# EAGLE design teensyMotors02_upSwitch_LED (EAGLE 9.1.3)
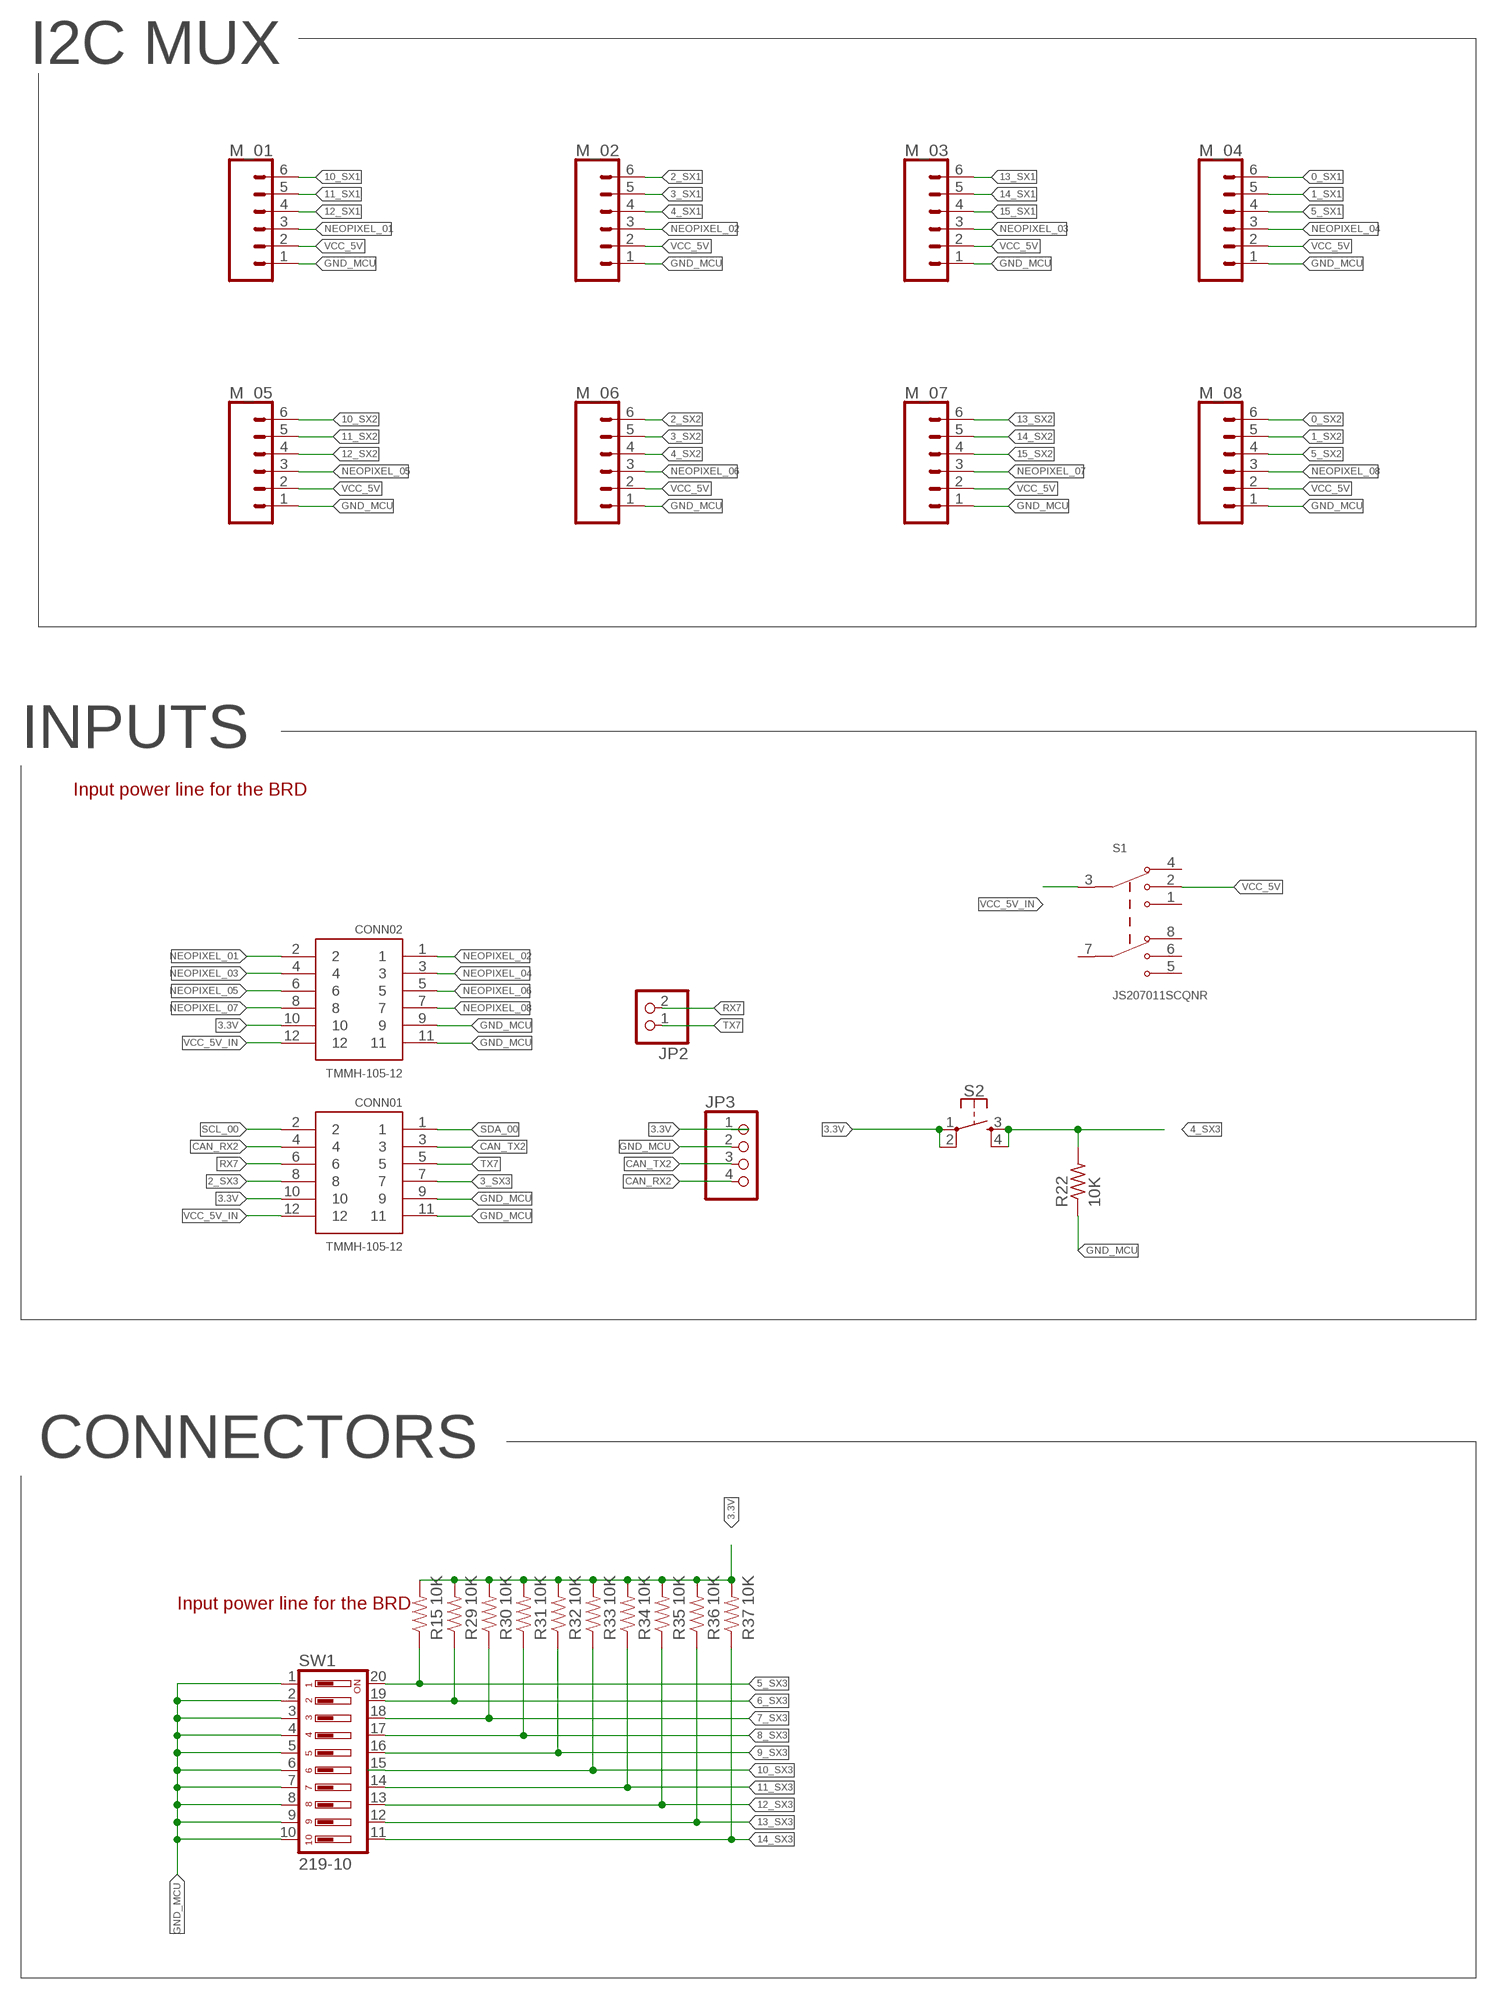
[diagram p0: schematic, sheet 1, part 1 of 3]
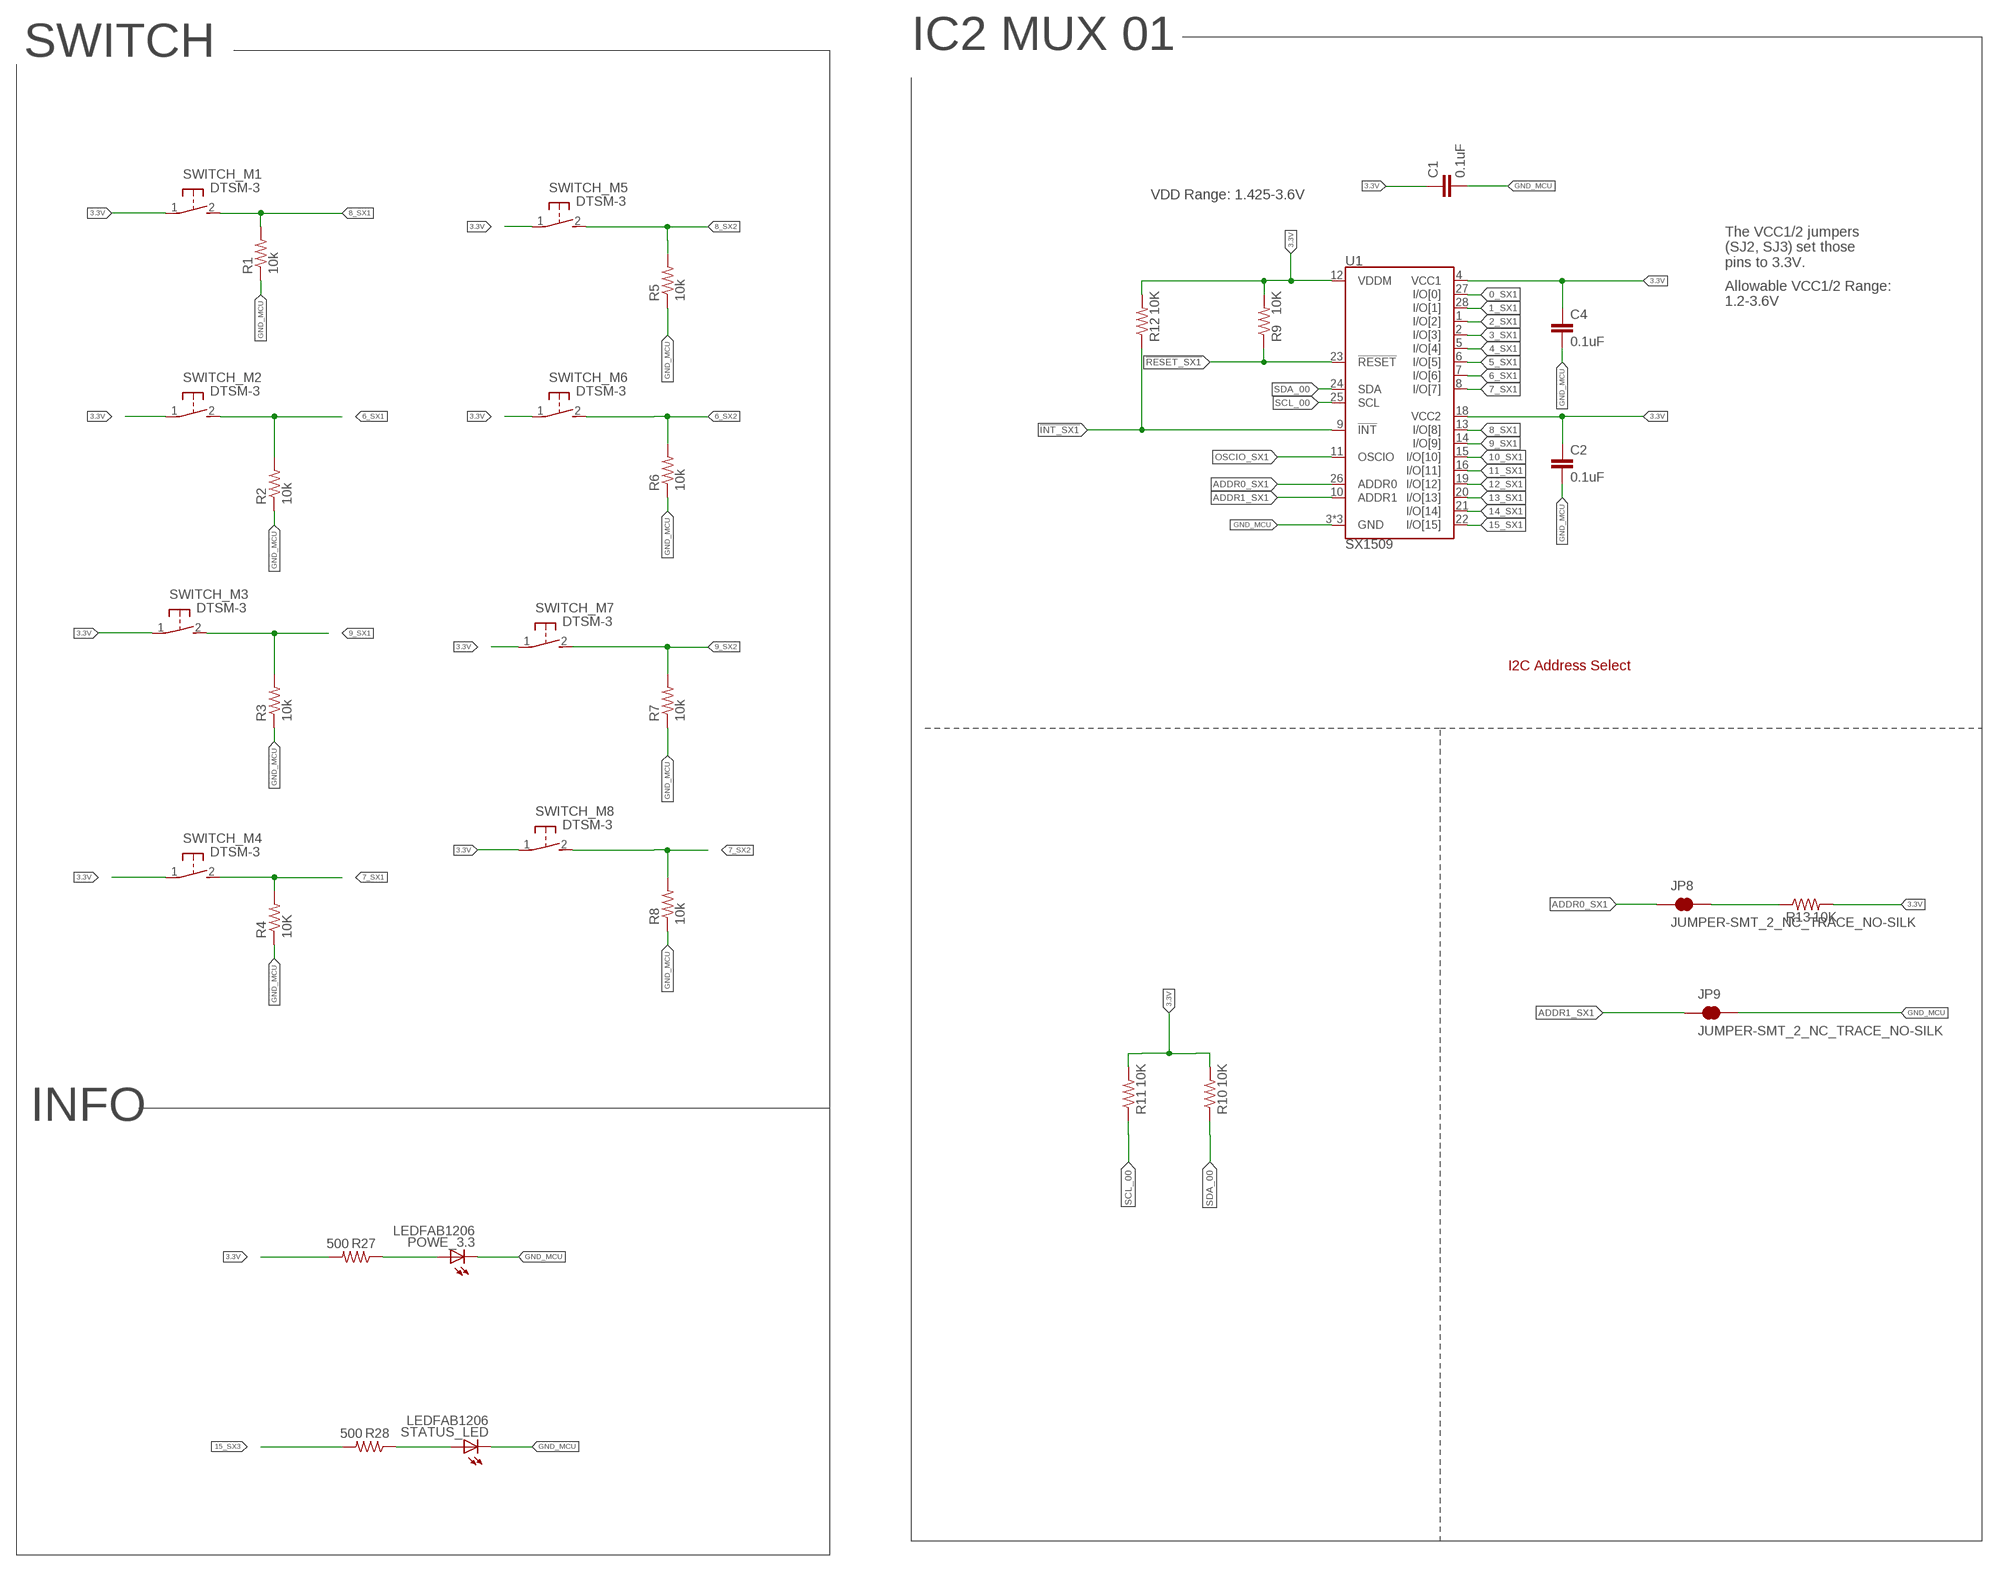
[diagram p1: schematic, sheet 1, part 2 of 3]
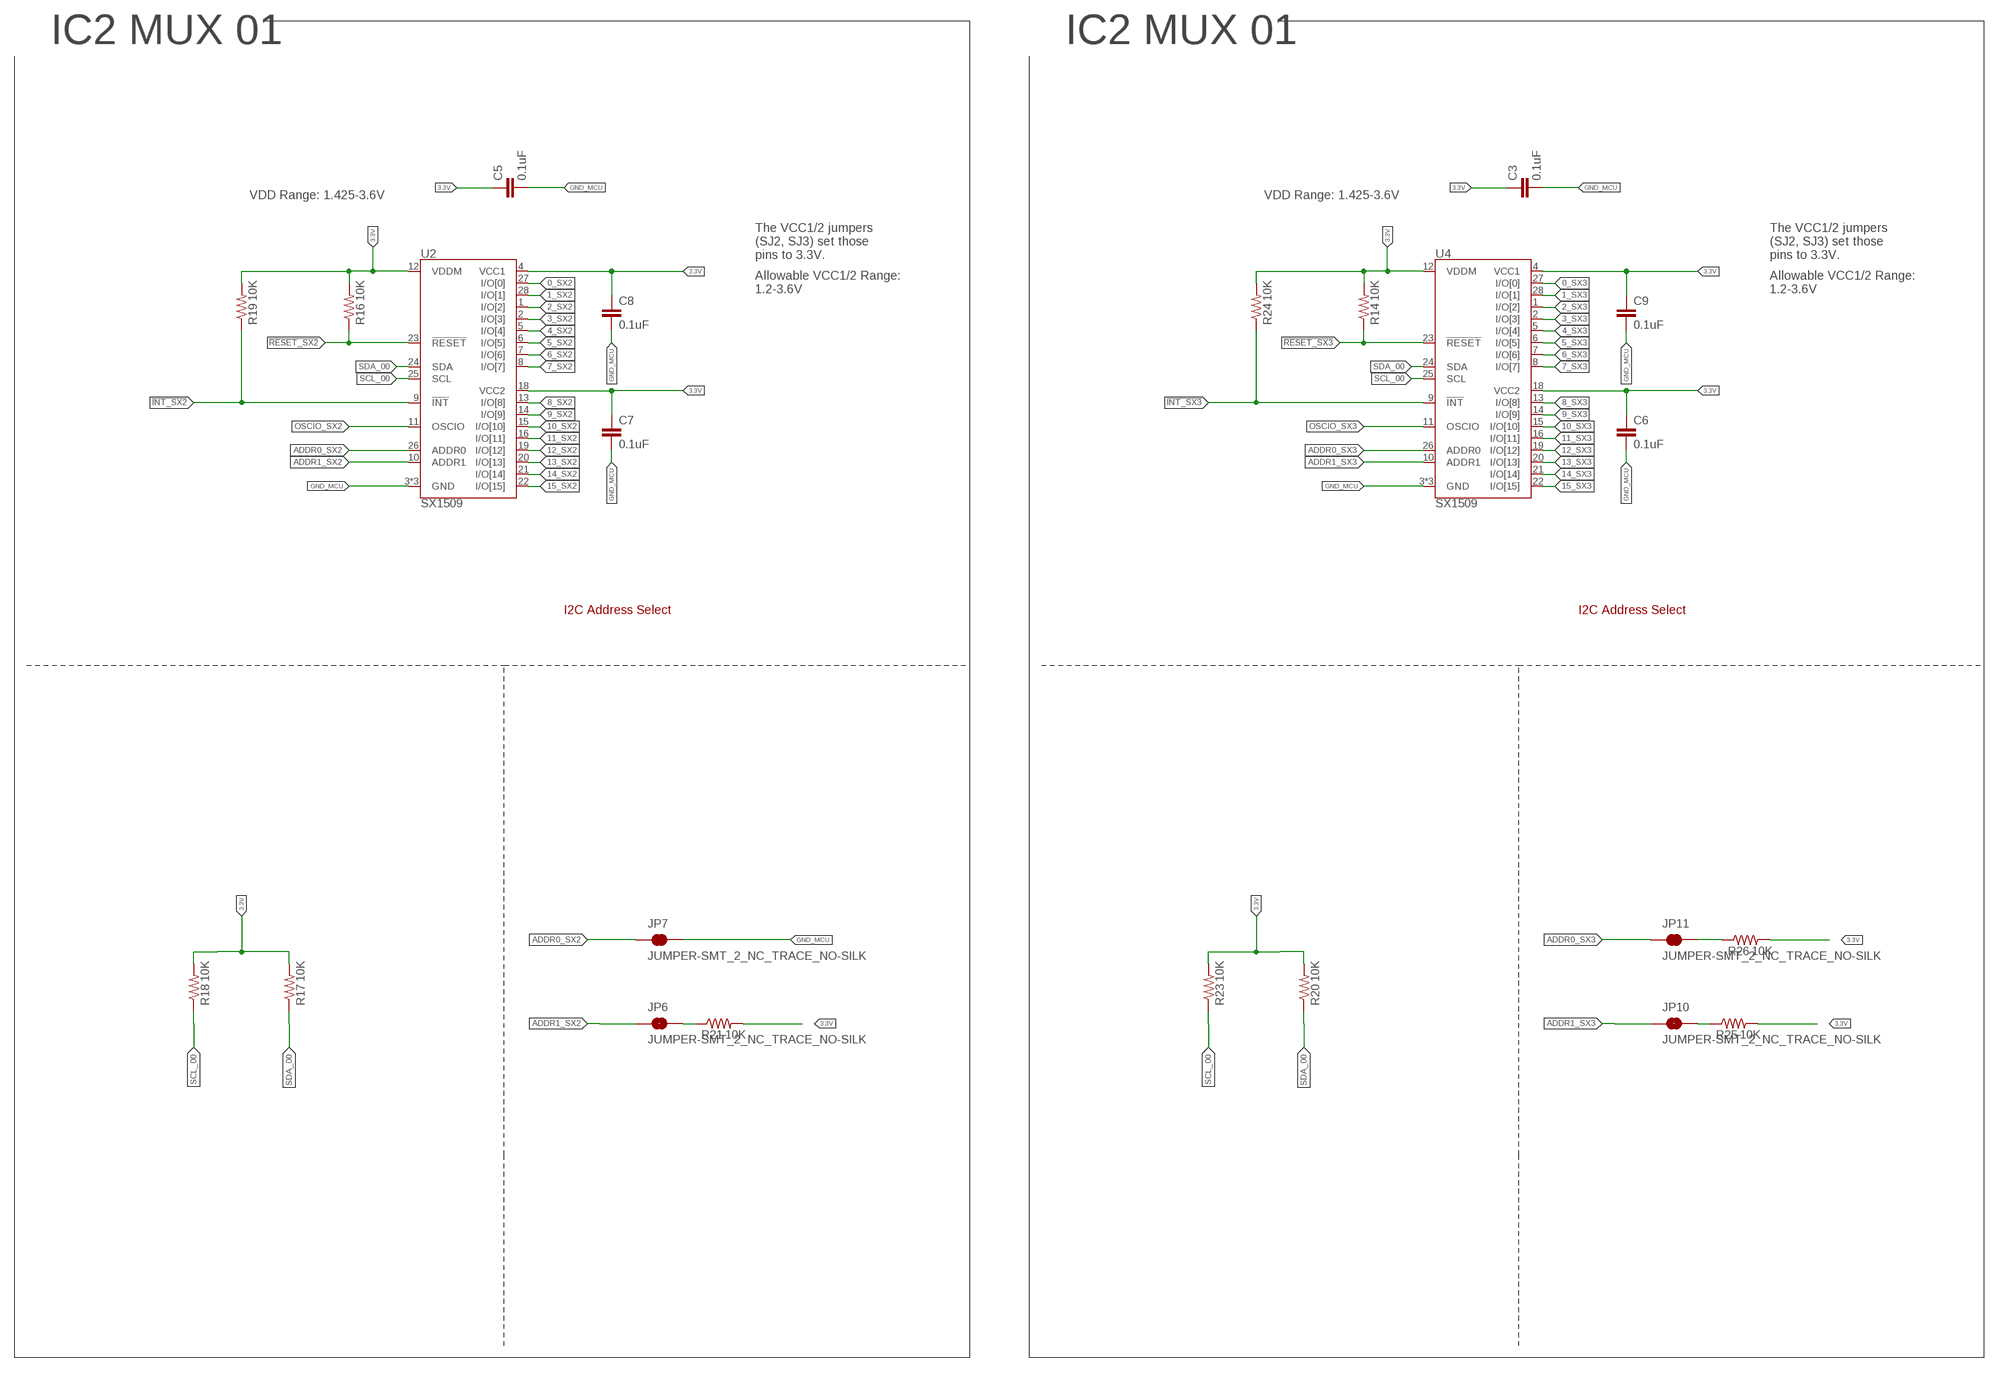
[diagram p2: schematic, sheet 1, part 3 of 3]

## Parts
C1  0.1uF  0.1UF-25V(+80/-20%)(0603)  [0603-CAP]
C2  0.1uF  0.1UF-25V(+80/-20%)(0603)  [0603-CAP]
C3  0.1uF  0.1UF-25V(+80/-20%)(0603)  [0603-CAP]
C4  0.1uF  0.1UF-25V(+80/-20%)(0603)  [0603-CAP]
C5  0.1uF  0.1UF-25V(+80/-20%)(0603)  [0603-CAP]
C6  0.1uF  0.1UF-25V(+80/-20%)(0603)  [0603-CAP]
C7  0.1uF  0.1UF-25V(+80/-20%)(0603)  [0603-CAP]
C8  0.1uF  0.1UF-25V(+80/-20%)(0603)  [0603-CAP]
C9  0.1uF  0.1UF-25V(+80/-20%)(0603)  [0603-CAP]
CONN01  TMMH-105-12  [TMMH-105-12]
CONN02  TMMH-105-12  [TMMH-105-12]
JP2  HEADER-1X2ROUND  [1X02_ROUND]
JP3  HEADER-1X4ROUND  [1X04_ROUND]
JP6  JUMPER-SMT_2_NC_TRACE_NO-SILK  [SMT-JUMPER_2_NC_TRACE_NO-SILK]
JP7  JUMPER-SMT_2_NC_TRACE_NO-SILK  [SMT-JUMPER_2_NC_TRACE_NO-SILK]
JP8  JUMPER-SMT_2_NC_TRACE_NO-SILK  [SMT-JUMPER_2_NC_TRACE_NO-SILK]
JP9  JUMPER-SMT_2_NC_TRACE_NO-SILK  [SMT-JUMPER_2_NC_TRACE_NO-SILK]
JP10  JUMPER-SMT_2_NC_TRACE_NO-SILK  [SMT-JUMPER_2_NC_TRACE_NO-SILK]
JP11  JUMPER-SMT_2_NC_TRACE_NO-SILK  [SMT-JUMPER_2_NC_TRACE_NO-SILK]
M_01  CONN_06SMD-1MM  [1X06-1MM]
M_02  CONN_06SMD-1MM  [1X06-1MM]
M_03  CONN_06SMD-1MM  [1X06-1MM]
M_04  CONN_06SMD-1MM  [1X06-1MM]
M_05  CONN_06SMD-1MM  [1X06-1MM]
M_06  CONN_06SMD-1MM  [1X06-1MM]
M_07  CONN_06SMD-1MM  [1X06-1MM]
M_08  CONN_06SMD-1MM  [1X06-1MM]
POWE_3.3  LEDFAB1206  [LED1206FAB]
R1  10k  R-US_M0805  [M0805]
R2  10k  R-US_M0805  [M0805]
R3  10k  R-US_M0805  [M0805]
R4  10K  R-US_M0805  [M0805]
R5  10k  R-US_M0805  [M0805]
R6  10k  R-US_M0805  [M0805]
R7  10k  R-US_M0805  [M0805]
R8  10k  R-US_M0805  [M0805]
R9  10K  10KOHM-1/10W-1%(0603)0603  [0603-RES]
R10  10K  10KOHM-1/10W-1%(0603)0603  [0603-RES]
R11  10K  10KOHM-1/10W-1%(0603)0603  [0603-RES]
R12  10K  10KOHM-1/10W-1%(0603)0603  [0603-RES]
R13  10K  10KOHM-1/10W-1%(0603)0603  [0603-RES]
R14  10K  10KOHM-1/10W-1%(0603)0603  [0603-RES]
R15  10K  10KOHM-1/10W-1%(0603)0603  [0603-RES]
R16  10K  10KOHM-1/10W-1%(0603)0603  [0603-RES]
R17  10K  10KOHM-1/10W-1%(0603)0603  [0603-RES]
R18  10K  10KOHM-1/10W-1%(0603)0603  [0603-RES]
R19  10K  10KOHM-1/10W-1%(0603)0603  [0603-RES]
R20  10K  10KOHM-1/10W-1%(0603)0603  [0603-RES]
R21  10K  10KOHM-1/10W-1%(0603)0603  [0603-RES]
R22  10K  R-US_M0805  [M0805]
R23  10K  10KOHM-1/10W-1%(0603)0603  [0603-RES]
R24  10K  10KOHM-1/10W-1%(0603)0603  [0603-RES]
R25  10K  10KOHM-1/10W-1%(0603)0603  [0603-RES]
R26  10K  10KOHM-1/10W-1%(0603)0603  [0603-RES]
R27  500  10KOHM-1/10W-1%(0603)0603  [0603-RES]
R28  500  10KOHM-1/10W-1%(0603)0603  [0603-RES]
R29  10K  10KOHM-1/10W-1%(0603)0603  [0603-RES]
R30  10K  10KOHM-1/10W-1%(0603)0603  [0603-RES]
R31  10K  10KOHM-1/10W-1%(0603)0603  [0603-RES]
R32  10K  10KOHM-1/10W-1%(0603)0603  [0603-RES]
R33  10K  10KOHM-1/10W-1%(0603)0603  [0603-RES]
R34  10K  10KOHM-1/10W-1%(0603)0603  [0603-RES]
R35  10K  10KOHM-1/10W-1%(0603)0603  [0603-RES]
R36  10K  10KOHM-1/10W-1%(0603)0603  [0603-RES]
R37  10K  10KOHM-1/10W-1%(0603)0603  [0603-RES]
S1  JS207011SCQNR  [SW_JS207011SCQNR]
S2  MOMENTARY-SWITCH-SPST-2-SMD-5.2MM  [TACTILE_SWITCH_SMD_5.2MM]
STATUS_LED  LEDFAB1206  [LED1206FAB]
SW1  219-10  [CTS-219-10]
SWITCH_M1  DTSM-3  [DTSM-3]
SWITCH_M2  DTSM-3  [DTSM-3]
SWITCH_M3  DTSM-3  [DTSM-3]
SWITCH_M4  DTSM-3  [DTSM-3]
SWITCH_M5  DTSM-3  [DTSM-3]
SWITCH_M6  DTSM-3  [DTSM-3]
SWITCH_M7  DTSM-3  [DTSM-3]
SWITCH_M8  DTSM-3  [DTSM-3]
U1  SX1509  [QFN-28]
U2  SX1509  [QFN-28]
U4  SX1509  [QFN-28]

## Nets
0_SX1: M_04.6 U1.27(I/O[0])
0_SX2: M_08.6 U2.27(I/O[0])
0_SX3: U4.27(I/O[0])
1_SX1: M_04.5 U1.28(I/O[1])
1_SX2: M_08.5 U2.28(I/O[1])
1_SX3: U4.28(I/O[1])
2_SX1: M_02.6 U1.1(I/O[2])
2_SX2: M_06.6 U2.1(I/O[2])
2_SX3: CONN01.8 U4.1(I/O[2])
3.3V: C1.1 C2.1 C3.1 C4.1 C5.1 C6.1 C7.1 C8.1 C9.1 CONN01.10 CONN02.10 JP3.1 R9.2 R10.2 R11.2 R12.2 R13.2 R14.2 R15.2 R16.2 R17.2 R18.2 R19.2 R20.2 R21.2 R23.2 R24.2 R25.2 R26.2 R27.2 R29.2 R30.2 R31.2 R32.2 R33.2 R34.2 R35.2 R36.2 R37.2 S2.1 S2.2 SWITCH_M1.1 SWITCH_M2.1 SWITCH_M3.1 SWITCH_M4.1 SWITCH_M5.1 SWITCH_M6.1 SWITCH_M7.1 SWITCH_M8.1 U1.4(VCC1) U1.12(VDDM) U1.18(VCC2) U2.4(VCC1) U2.12(VDDM) U2.18(VCC2) U4.4(VCC1) U4.12(VDDM) U4.18(VCC2)
3_SX1: M_02.5 U1.2(I/O[3])
3_SX2: M_06.5 U2.2(I/O[3])
3_SX3: CONN01.7 U4.2(I/O[3])
4_SX1: M_02.4 U1.5(I/O[4])
4_SX2: M_06.4 U2.5(I/O[4])
4_SX3: R22.2 S2.3 S2.4 U4.5(I/O[4])
5_SX1: M_04.4 U1.6(I/O[5])
5_SX2: M_08.4 U2.6(I/O[5])
5_SX3: R15.1 SW1.20 U4.6(I/O[5])
6_SX1: R2.2 SWITCH_M2.2 U1.7(I/O[6])
6_SX2: R6.2 SWITCH_M6.2 U2.7(I/O[6])
6_SX3: R29.1 SW1.19 U4.7(I/O[6])
7_SX1: R4.2 SWITCH_M4.2 U1.8(I/O[7])
7_SX2: R8.2 SWITCH_M8.2 U2.8(I/O[7])
7_SX3: R30.1 SW1.18 U4.8(I/O[7])
8_SX1: R1.2 SWITCH_M1.2 U1.13(I/O[8])
8_SX2: R5.2 SWITCH_M5.2 U2.13(I/O[8])
8_SX3: R31.1 SW1.17 U4.13(I/O[8])
9_SX1: R3.2 SWITCH_M3.2 U1.14(I/O[9])
9_SX2: R7.2 SWITCH_M7.2 U2.14(I/O[9])
9_SX3: R32.1 SW1.16 U4.14(I/O[9])
10_SX1: M_01.6 U1.15(I/O[10])
10_SX2: M_05.6 U2.15(I/O[10])
10_SX3: R33.1 SW1.15 U4.15(I/O[10])
11_SX1: M_01.5 U1.16(I/O[11])
11_SX2: M_05.5 U2.16(I/O[11])
11_SX3: R34.1 SW1.14 U4.16(I/O[11])
12_SX1: M_01.4 U1.19(I/O[12])
12_SX2: M_05.4 U2.19(I/O[12])
12_SX3: R35.1 SW1.13 U4.19(I/O[12])
13_SX1: M_03.6 U1.20(I/O[13])
13_SX2: M_07.6 U2.20(I/O[13])
13_SX3: R36.1 SW1.12 U4.20(I/O[13])
14_SX1: M_03.5 U1.21(I/O[14])
14_SX2: M_07.5 U2.21(I/O[14])
14_SX3: R37.1 SW1.11 U4.21(I/O[14])
15_SX1: M_03.4 U1.22(I/O[15])
15_SX2: M_07.4 U2.22(I/O[15])
15_SX3: R28.2 U4.22(I/O[15])
!INT_SX1: R12.1 U1.9(!INT)
!INT_SX2: R19.1 U2.9(!INT)
!INT_SX3: R24.1 U4.9(!INT)
!RESET_SX1: R9.1 U1.23(!RESET)
!RESET_SX2: R16.1 U2.23(!RESET)
!RESET_SX3: R14.1 U4.23(!RESET)
ADDR0_SX1: JP8.1 U1.26(ADDR0)
ADDR0_SX2: JP7.1 U2.26(ADDR0)
ADDR0_SX3: JP11.1 U4.26(ADDR0)
ADDR1_SX1: JP9.1 U1.10(ADDR1)
ADDR1_SX2: JP6.1 U2.10(ADDR1)
ADDR1_SX3: JP10.1 U4.10(ADDR1)
CAN_RX2: CONN01.4 JP3.4
CAN_TX2: CONN01.3 JP3.3
GND_MCU: C1.2 C2.2 C3.2 C4.2 C5.2 C6.2 C7.2 C8.2 C9.2 CONN01.9 CONN01.11 CONN02.9 CONN02.11 JP3.2 JP7.2 JP9.2 M_01.1 M_02.1 M_03.1 M_04.1 M_05.1 M_06.1 M_07.1 M_08.1 POWE_3.3.2(C) R1.1 R2.1 R3.1 R4.1 R5.1 R6.1 R7.1 R8.1 R22.1 STATUS_LED.2(C) SW1.1 SW1.2 SW1.3 SW1.4 SW1.5 SW1.6 SW1.7 SW1.8 SW1.9 SW1.10 U1.3(GND) U1.17(GND) U1.29(GND) U2.3(GND) U2.17(GND) U2.29(GND) U4.3(GND) U4.17(GND) U4.29(GND)
N$5: JP6.2 R21.1
N$8: JP8.2 R13.1
N$13: R28.1 STATUS_LED.1(A)
N$14: JP10.2 R25.1
N$15: JP11.2 R26.1
N$193: POWE_3.3.1(A) R27.1
NEOPIXEL_01: CONN02.2 M_01.3
NEOPIXEL_02: CONN02.1 M_02.3
NEOPIXEL_03: CONN02.4 M_03.3
NEOPIXEL_04: CONN02.3 M_04.3
NEOPIXEL_05: CONN02.6 M_05.3
NEOPIXEL_06: CONN02.5 M_06.3
NEOPIXEL_07: CONN02.8 M_07.3
NEOPIXEL_08: CONN02.7 M_08.3
OSCIO_SX1: U1.11(OSCIO)
OSCIO_SX2: U2.11(OSCIO)
OSCIO_SX3: U4.11(OSCIO)
RX7: CONN01.6 JP2.2
SCL_00: CONN01.2 R11.1 R18.1 R23.1 U1.25(SCL) U2.25(SCL) U4.25(SCL)
SDA_00: CONN01.1 R10.1 R17.1 R20.1 U1.24(SDA) U2.24(SDA) U4.24(SDA)
TX7: CONN01.5 JP2.1
VCC_5V [5v]: M_01.2 M_02.2 M_03.2 M_04.2 M_05.2 M_06.2 M_07.2 M_08.2 S1.2
VCC_5V_IN [5v]: CONN01.12 CONN02.12 S1.3
Unconnected: S1.1 S1.4 S1.5 S1.6 S1.7 S1.8

## Notes on the sheet
- I2C MUX | SWITCH | IC2 MUX 01 | IC2 MUX 01 | IC2 MUX 01
- VDD Range: 1.425-3.6V
- VDD Range: 1.425-3.6V | VDD Range: 1.425-3.6V
- The VCC1/2 jumpers 
  (SJ2, SJ3) set those 
  pins to 3.3V.
- Allowable VCC1/2 Range: 
  1.2-3.6V
- The VCC1/2 jumpers 
  (SJ2, SJ3) set those 
  pins to 3.3V.
- The VCC1/2 jumpers 
  (SJ2, SJ3) set those 
  pins to 3.3V.
- Allowable VCC1/2 Range: 
  1.2-3.6V
- Allowable VCC1/2 Range: 
  1.2-3.6V
- INPUTS
- Input power line for the BRD
- I2C Address Select
- I2C Address Select | I2C Address Select
- INFO
- CONNECTORS
- Input power line for the BRD

## Library data of the parts
C1-C9 = SparkFun-Capacitors:0.1UF-25V(+80/-20%)(0603): CAP-00810 Ceramic Standard decoupling cap; PROD_ID: CAP-00810
CONN01 CONN02 = TMMH-105-XX-XX-DV:TMMH-105-12: 2mm (.0787") Flex Shroud, .020" (.51mm) Square Post Terminal Strip, Surface Mount,10 Pins.
JP2 = microbuilder:HEADER-1X2: PIN HEADER
JP3 = microbuilder:HEADER-1X4: PIN HEADER
JP6-JP11 = SparkFun-Jumpers:JUMPER-SMT_2_NC_TRACE: Normally closed trace jumper This jumper has a trace between two pads so it's normally closed (NC). Use a razor knife to open the connection. For best results follow the IPC guidelines for cutting traces: Cutout at least 0.063 mm (0.005 in). Remove all loose material to clean up the cut area. Seal the cut with an approved epoxy. Reapply solder to reclose the connection.
M_01-M_08 = SparkFun-Connectors:CONN_06: Multi connection point. Often used as Generic Header-pin footprint for 0.1 inch spaced/style header connections On any of the 0.1 inch spaced packages, you can populate with these: Break Away Headers - Straight <https://www.sparkfun.com/products/116> (PRT-00116) Break Away Male Headers - Right Angle <https://www.sparkfun.com/products/553> (PRT-00553) Female Headers <https://www.sparkfun.com/products/115> (PRT-00115) Break Away Headers - Machine Pin <https://www.sparkfun.com/products/117> (PRT-00117) Break Away Female Headers - Swiss Machine Pin <https://www.sparkfun.com/products/743> (PRT-00743) Arduino Stackable Header - 6 Pin <https://www.sparkfun.com/products/9280> (PRT-09280) For SCREWTERMINALS and SPRING TERMINALS visit here: Screw Terimnals on SparkFun.com <https://www.sparkfun.com/search/results?term=Screw+Terminals> (5mm/3.5mm/2.54mm spacing) This device is also useful as a general connection point to wire up your design to another part of your project. Our various solder wires solder well into these plated through hole pads. Hook-Up Wire - Assortment (Stranded, 22 AWG) <https://www.sparkfun.com/products/11375> (PRT-11375) Hook-Up Wire - Assortment (Solid Core, 22 AWG) <https://www.sparkfun.com/products/11367> (PRT-11367) View the entire wire category on our website here <https://www.sparkfun.com/categories/141>; PROD_ID: CONN-08249; SF_ID: GPS-00579
POWE_3.3 STATUS_LED = fab:LED: LED
R1-R8 R22 = resistor:R-US_: RESISTOR, American symbol
R9-R21 R23-R26 R29-R37 = SparkFun-Resistors:10KOHM-1/10W-1%(0603): RES-00824; PROD_ID: RES-00824
R27 R28 = SparkFun-Resistors:10KOHM-1/10W-1%(0603): RES-00824; PROD_ID: RES-00824; VALUE: 10K
S1 = JS207011SCQNR:JS207011SCQNR: Js Series Sub-Miniature Slide Switches; AVAILABILITY: Unavailable; DESCRIPTION: Slide Switch DP3T Surface Mount; MF: C&K; MP: JS207011SCQNR; PACKAGE: None; PRICE: None
S2 = SparkFun-Switches:MOMENTARY-SWITCH-SPST-2: Momentary Switch (Pushbutton) - SPST - Two Circuits Normally-open (NO) SPST momentary switches (buttons, pushbuttons). Schematic symbol includes two switch circuits. Variants SMD-4.6MMX2.8MM - 4.60mm x 2.80mm Tactile Momentary Button Switch - Used on SparkFun SAMD21 Mini Breakout <https://www.sparkfun.com/products/13664> SMD-5.2MM - Mini Pushbutton Switch - SMD <https://www.sparkfun.com/products/8720> - Used on Arduino Pro Mini <https://www.sparkfun.com/products/11114>; PROD_ID: SWCH-08247; SF_SKU: COM-08720
SW1 = switch-dil:219-10*: Surface Mount DIP Switch Series 219 SMT CTS Electronic Components Sourc: www.ctscorp.com; MF: SLI (CML/IDI); MPN: 219-10PK; OC_FARNELL: unknown; OC_NEWARK: 19M0224
SWITCH_M1-SWITCH_M8 = switch-tact:DTSM-3
U1 U2 U4 = SparkFun-DigitalIC:SX1509: Semtech SX1509 The SX1509 is a complete ultra low voltage 1.2V to 3.6V General Purpose parallel Input/Output (GPIO) expanders ideal for low power handheld battery powered equipment. This version comes in a 16-channel configuration and allows easy serial expansion of I/O through a standard 400kHz I2C interface. GPIO devices can provide additional control and monitoring when the microcontroller or chipset has insufficient I/O ports, or in systems where serial communication and control from a remote location is advantageous.; PROD_ID: IC-11311

## Net classes
0 default: width 0.2 mm, clearance 0.2 mm
1 gnd: width 0.2 mm, clearance 0.2 mm
4 5v: width 0.35 mm, clearance 0.2 mm

## Board
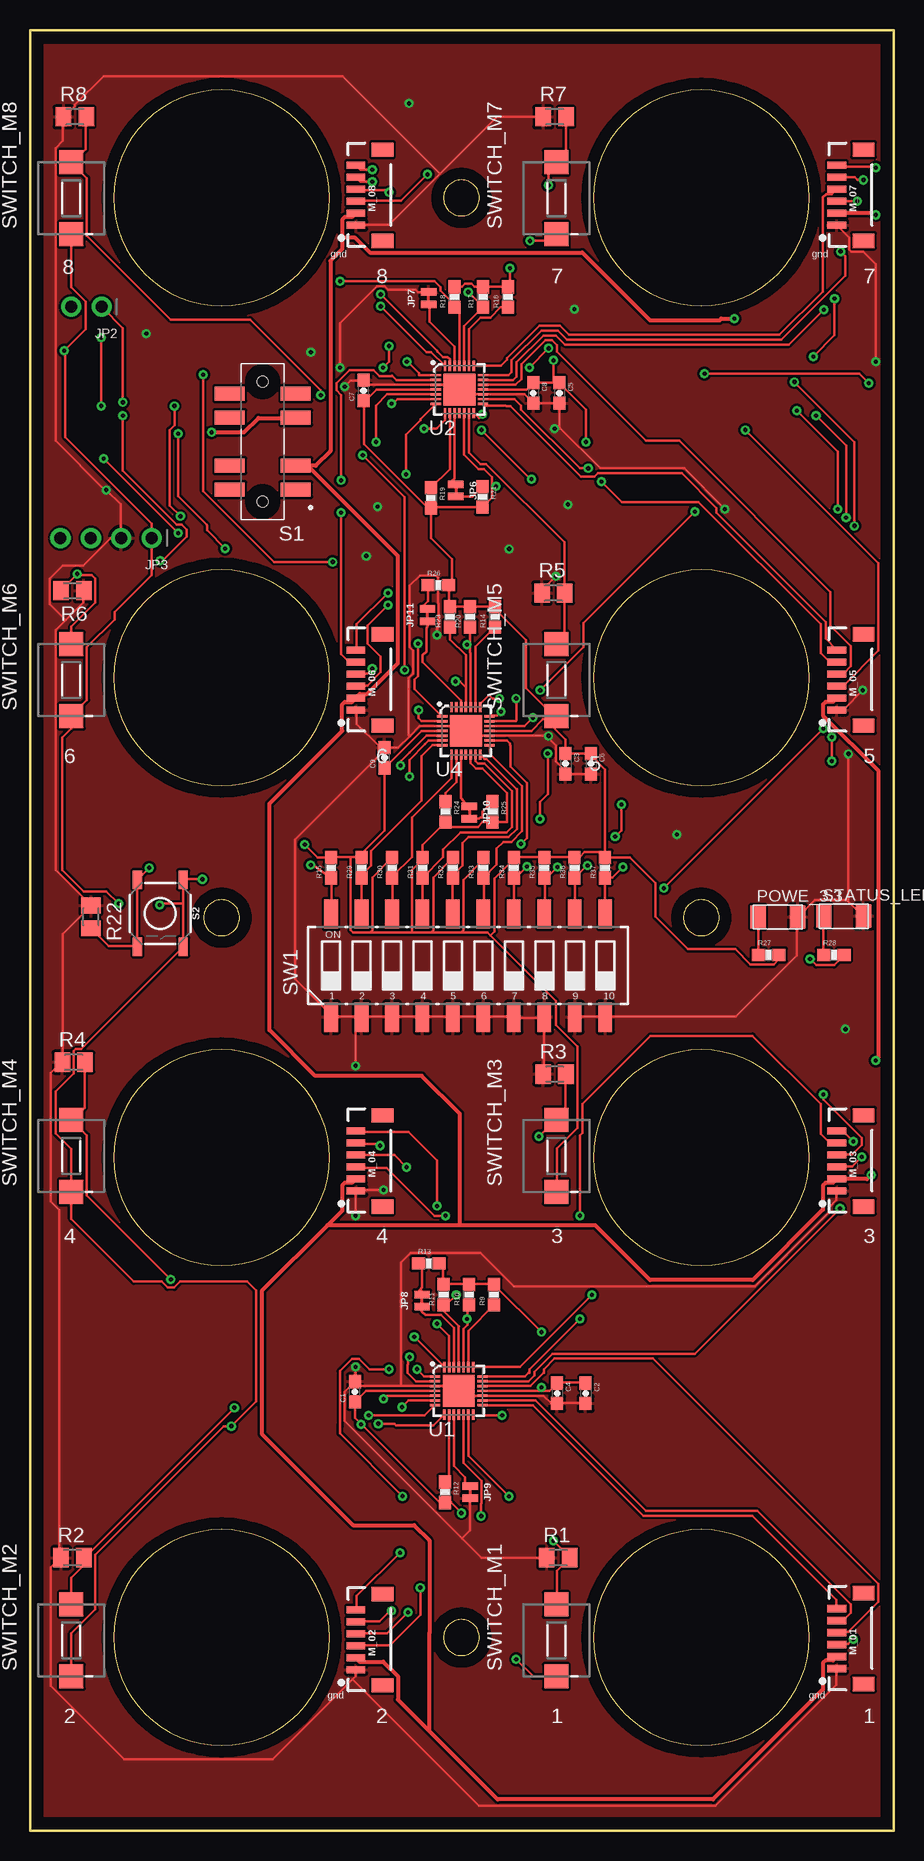
[diagram p3: board, top side]
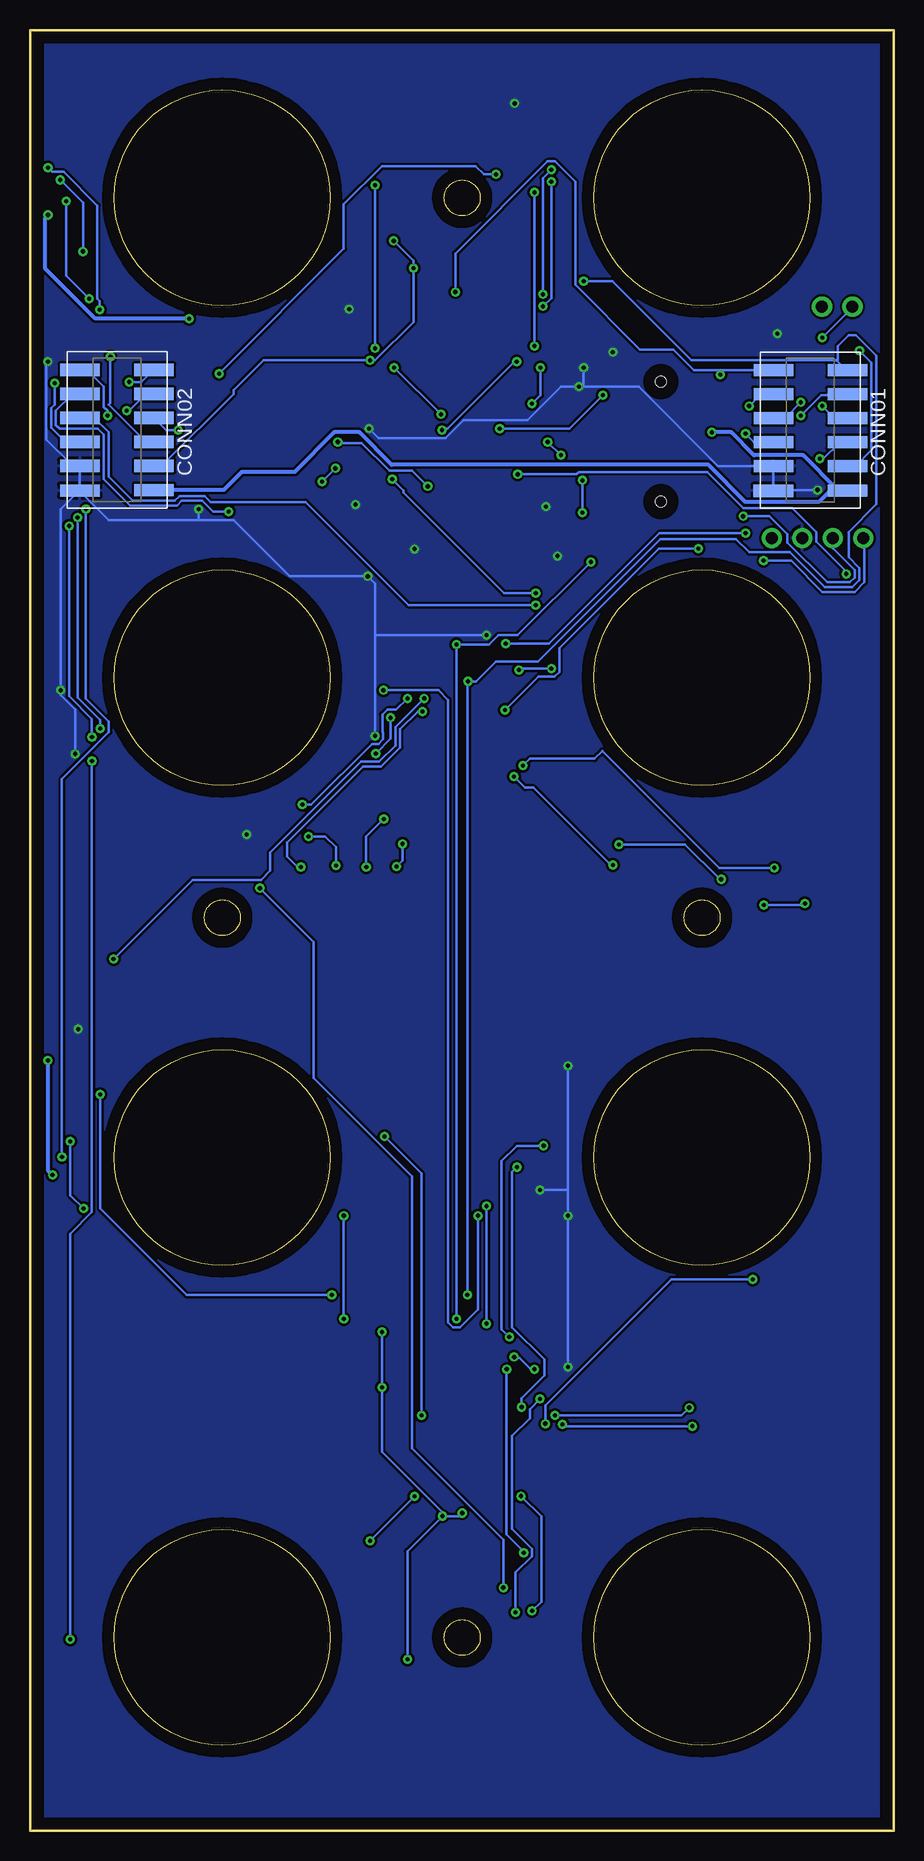
[diagram p4: board, bottom side, seen from below]

Size 72.01 x 150.09 mm. Coordinates in mm from the lower left corner, seen from the top.
Outline: 35.97,14.59 arc180 35.97,17.59 arc180 35.97,14.59
Outline: 15.97,74.59 arc180 15.97,77.59 arc180 15.97,74.59
Outline: 35.97,134.59 arc180 35.97,137.59 arc180 35.97,134.59
Outline: 55.97,74.59 arc180 55.97,77.59 arc180 55.97,74.59
Outline: 15.97,127.09 arc180 15.97,145.09 arc180 15.97,127.09
Outline: 55.97,127.09 arc180 55.97,145.09 arc180 55.97,127.09
Outline: 55.97,87.09 arc180 55.97,105.09 arc180 55.97,87.09
Outline: 55.97,47.09 arc180 55.97,65.09 arc180 55.97,47.09
Outline: 55.97,7.09 arc180 55.97,25.09 arc180 55.97,7.09
Outline: 15.97,7.09 arc180 15.97,25.09 arc180 15.97,7.09
Outline: 15.97,47.09 arc180 15.97,65.09 arc180 15.97,47.09
Outline: 15.97,87.09 arc180 15.97,105.09 arc180 15.97,87.09
Outline: 72.01,150.09 72.01,0 0,0 0,150.09 72.01,150.09
Copper layers (1*16): Top 0.035mm / dielectric 1.5mm / Bottom 0.035mm
Design rules "default": minimum track width 6mil, minimum drill 0.35mm, track to track 6mil, track to pad 6mil, pad to pad 6mil, via to via 6mil, smd to smd 6mil, copper to edge 40mil, drill to drill 6mil, minimum pad ring 10mil, minimum via ring 8mil, stop-mask expansion 4mil, vias tented up to drill 0mil, thermal gap 10mil

### Footprints (pad centres in the part's own frame; a part is rotated, then mirrored left to right if it is on the bottom)
0603-CAP = smd 1.1 x 1: 1 -0.85,0; 2 0.85,0
TMMH-105-12 = smd 1.016 x 3.302: 1 -5.27,-3.086; 2 -5.27,3.086; 3 -3.27,-3.086; 4 -3.27,3.086; 5 -1.27,-3.086; 6 -1.27,3.086; 7 0.73,-3.086; 8 0.73,3.086; 9 2.73,-3.086; 10 2.73,3.086; 11 4.781,-3.099; 12 4.755,3.086
1X02_ROUND = drill 1 pad 1.676: 1 -1.27,0; 2 1.27,0
1X04_ROUND = drill 1 pad 1.676: 1 -3.81,0; 2 -1.27,0; 3 1.27,0; 4 3.81,0
SMT-JUMPER_2_NC_TRACE_NO-SILK = smd 0.635 x 1.27: 1 -0.508,0; 2 0.508,0
1X06-1MM = smd 0.6 x 1.55: 1 -2.54,1.27; 2 -1.54,1.27; 3 -0.54,1.27; 4 0.46,1.27; 5 1.46,1.27; 6 2.46,1.27 | smd 1.2 x 1.8: P$1 -3.84,-0.955; P$2 3.76,-0.955
LED1206FAB = smd 1.27 x 1.905: 1 -1.651,0; 2 1.651,0
M0805 = smd 1.3 x 1.6: 1 -0.95,0; 2 0.95,0
0603-RES = smd 1.1 x 1: 1 -0.85,0; 2 0.85,0
SW_JS207011SCQNR = smd 2.5 x 1.2: 1 -2.75,4; 2 -2.75,2; 3 -2.75,-2; 4 -2.75,-4; 5 2.75,4; 6 2.75,2; 7 2.75,-2; 8 2.75,-4 | hole 0.9: 0,5; 0,-5
TACTILE_SWITCH_SMD_5.2MM = smd 1.524 x 0.762: 1 -2.794,1.905; 2 2.794,1.905; 3 -2.794,-1.905; 4 2.794,-1.905
CTS-219-10 = smd 1.13 x 2.44: 1 -11.43,-4.3; 2 -8.89,-4.3; 3 -6.35,-4.3; 4 -3.81,-4.3; 5 -1.27,-4.3; 6 1.27,-4.3; 7 3.81,-4.3; 8 6.35,-4.3; 9 8.89,-4.3; 10 11.43,-4.3; 11 11.43,4.3; 12 8.89,4.3; 13 6.35,4.3; 14 3.81,4.3; 15 1.27,4.3; 16 -1.27,4.3; 17 -3.81,4.3; 18 -6.35,4.3; 19 -8.89,4.3; 20 -11.43,4.3
DTSM-3 = smd 2 x 2: 1 -3,0; 2 3,0
QFN-28 = smd 0.85 x 0.2: 1 -1.975,1.2; 2 -1.975,0.8; 3 -1.975,0.4; 4 -1.975,0; 5 -1.975,-0.4; 6 -1.975,-0.8; 7 -1.975,-1.2; 15 1.975,-1.2; 16 1.975,-0.8; 17 1.975,-0.4; 18 1.975,0; 19 1.975,0.4; 20 1.975,0.8; 21 1.975,1.2 | smd 0.2 x 0.85: 8 -1.2,-1.975; 9 -0.8,-1.975; 10 -0.4,-1.975; 11 0,-1.975; 12 0.4,-1.975; 13 0.8,-1.975; 14 1.2,-1.975; 22 1.2,1.975; 23 0.8,1.975; 24 0.4,1.975; 25 0,1.975; 26 -0.4,1.975; 27 -0.8,1.975; 28 -1.2,1.975 | smd 2.65 x 2.65: 29 0,0

### Placement (x,y rotation side)
C1  27.08,36.57 90 top
C2  46.33,36.45 270 top
C3  44.65,88.93 270 top
C4  43.95,36.45 270 top
C5  44.14,119.83 270 top
C6  46.76,88.93 270 top
C7  27.82,120.04 90 top
C8  41.97,119.83 270 top
C9  29.57,89.43 90 top
CONN01  6.93,116.46 270 bottom
CONN02  64.75,116.48 270 bottom
JP2  4.7,127.03 180 top
JP3  6.35,107.75 180 top
JP6  35.51,111.71 270 top
JP7  33.25,127.74 90 top
JP8  32.69,44.17 90 top
JP9  36.7,28.22 270 top
JP10  36.63,84.86 270 top
JP11  33.15,101.32 90 top
M_01  68.54,16.05 90 top
M_02  28.44,15.95 90 top
M_03  68.54,55.85 90 top
M_04  28.44,55.85 90 top
M_05  68.54,95.95 90 top
M_06  28.44,95.95 90 top
M_07  68.54,136.35 90 top
M_08  28.44,136.35 90 top
POWE_3.3  62.36,76.15 0 top
R1  44.04,22.75 0 top
R2  3.54,22.75 0 top
R3  43.74,63.05 0 top
R4  3.64,64.05 0 top
R5  43.64,103.15 0 top
R6  3.54,103.35 180 top
R7  43.74,142.85 0 top
R8  3.74,142.85 0 top
R9  38.7,44.66 90 top
R10  36.6,44.66 90 top
R11  34.5,44.66 90 top
R12  34.59,28.2 270 top
R13  33.25,47.27 0 top
R14  38.76,101.17 90 top
R15  25.1,80.26 90 top
R16  39.86,127.82 90 top
R17  37.76,127.82 90 top
R18  35.41,127.82 90 top
R19  33.45,111.1 270 top
R20  36.7,101.17 90 top
R21  37.72,111.18 270 top
R22  5.09,76.16 270 top
R23  35.03,101.17 90 top
R24  34.65,84.91 270 top
R25  38.58,84.91 270 top
R26  34.04,103.81 0 top
R27  61.59,73 0 top
R28  67.03,73 0 top
R29  27.64,80.26 90 top
R30  30.18,80.26 90 top
R31  32.72,80.26 90 top
R32  35.26,80.26 90 top
R33  37.8,80.26 90 top
R34  40.34,80.26 90 top
R35  42.88,80.26 90 top
R36  45.42,80.26 90 top
R37  47.96,80.26 90 top
S1  19.41,115.77 180 top
S2  10.86,76.46 270 top
STATUS_LED  67.84,76.23 0 top
SW1  36.54,72.11 0 top
SWITCH_M1  43.89,15.85 90 top
SWITCH_M2  3.44,15.85 90 top
SWITCH_M3  43.89,56.25 90 top
SWITCH_M4  3.44,56.25 90 top
SWITCH_M5  43.89,95.9 90 top
SWITCH_M6  3.44,95.9 90 top
SWITCH_M7  43.89,136.05 90 top
SWITCH_M8  3.44,136.05 90 top
U1  35.74,36.65 0 top
U2  35.8,120.12 0 top
U4  36.35,91.67 0 top

### Tracks (layer width: path | path; a pad name or v marks a point on that pad's centre or on a via)
0_SX1  (via drill 0.35)
  Top 0.2: U1.27 34.94,41.25 v33.94,42.25 | M_04.6 27.24,58.25 31.55,58.25 33.94,55.86 v33.94,52.05
  Bottom 0.2: v33.94,52.05 v33.94,42.25
0_SX2  (via drill 0.35)
  Top 0.2: U2.27 35,122.64 34.82,122.82 34.44,122.82 33.98,123.28 33.94,123.35 v29.24,128.05 | v28.54,138.45 27.54,138.45 27.24,138.75 M_08.6
  Bottom 0.2: v29.24,128.05 29.24,137.75 v28.54,138.45
1_SX1  (via drill 0.35)
  Top 0.2: v32.04,41.15 34.54,38.65 U1.28 | v29.18,57.09 29.01,57.25 27.24,57.25 M_04.5
  Bottom 0.2: v29.18,57.09 31.41,57.09 32.68,55.82 32.68,41.79 v32.04,41.15
1_SX2  (via drill 0.35)
  Top 0.2: U2.28 33.45,123.24 33.3,123.24 33.24,123.25 33.04,123.25 v29.24,127.05 | v28.54,137.45 27.54,137.45 27.24,137.75 M_08.5
  Bottom 0.2: v29.24,127.05 28.54,127.75 v28.54,137.45
2_SX1  (via drill 0.35)
  Top 0.2: U1.1 32.87,37.85 v32.26,38.46 | v30.84,23.15 27.24,19.55 27.24,18.45 M_02.6
  Bottom 0.2: v32.26,38.46 32.26,24.69 30.84,23.28 v30.84,23.15
2_SX2  (via drill 0.35)
  Top 0.2: U2.1 33.81,121.34 32.44,121.34 32.44,121.48 31.48,122.44 v31.42,122.44 | v29.84,103.15 27.24,100.55 27.24,98.45 M_06.6 | v41.8,112.65 41.74,112.65 v37.64,116.75
  Bottom 0.2: v29.84,103.15 32.5,103.15 40.86,111.51 40.86,111.71 v41.8,112.65 | v37.64,116.75 37.54,116.85 37.19,116.85 31.6,122.44 v31.42,122.44
2_SX3  (via drill 0.35)
  Top 0.2: U4.1 34.33,92.87 32.04,95.16 32.04,95.95 32.34,96.25 v32.34,98.95 | v6.14,114.35 v12.34,108.15
  Bottom 0.2: v32.34,98.95 28.74,98.95 19.54,108.15 v12.34,108.15 | v6.14,114.35 5.84,114.35 4.54,115.65 3.94,115.65 CONN01.8
3.3V  (via drill 0.35)
  Top 0.2: U4.4 32.65,91.67 C9.1 29.54,88.55 29.54,83.35 27.54,81.35 27.54,81.25 R29.2 27.54,81.15 26.74,81.15 | R19.2 33.53,110.33 R21.2 38.52,111.13 38.52,112.05 | R19.2 33.45,107.72 35.2,105.97 35.2,104.32 34.89,104 R26.2 34.94,103.75 34.94,102.05 R23.2 R20.2 R14.2 38.84,101.95 38.84,101.75 41.34,99.25 41.34,95.25 43.74,92.85 SWITCH_M5.1 43.69,92.66 | v22.91,82.19 23.99,81.11 R15.2 25.14,81.15 26.74,81.15 | v14.38,79.3 12.81,79.3 S2.1 12.77,77.27 | 12.77,77.27 S2.2 4.25,65.15 3.82,65.15 3.64,64.97 3.64,63.13 2.14,61.63 2.14,58.13 3.44,56.83 SWITCH_M4.1 3.44,50.99 8.66,45.77 10.97,45.77 11.46,45.27 12.03,45.27 12.52,45.77 18.09,45.77 18.85,45.01 18.85,35.77 v16.79,33.71 16.15,33.71 5.44,23 5.44,18.43 3.44,16.43 SWITCH_M2.1 | v7.39,77.27 6.37,78.29 4.47,78.29 2.69,80.07 2.69,91.11 3.44,91.86 SWITCH_M6.1 3.44,92.95 4.74,94.25 4.74,98.65 7.04,100.95 7.04,101.55 10.14,104.65 10.14,107.65 JP3.1 10.14,107.75 10.14,108.95 2.94,116.15 2.94,123.35 v2.84,123.35 4.64,125.15 4.64,127.45 3.44,128.65 SWITCH_M8.1 | v10.82,77.14 10.95,77.27 12.77,77.27 | U1.4 28.01,36.65 C1.1 27.08,34.4 v27.62,33.86 27.64,33.85 34.14,27.35 34.54,27.35 R12.2 35.09,27.35 v35.97,26.47 | U1.18 42.64,36.65 | 42.64,36.65 43.3,36.65 C4.1 44.04,37.35 46.24,37.35 C2.1 | v37.62,26.21 37.62,27.25 37.64,27.27 37.64,29.17 36.14,30.66 U1.12 | v40.54,14.27 41.96,12.85 SWITCH_M1.1 | R37.2 50.03,81.11 52.17,78.97 52.17,76.18 54.87,73.47 58.8,73.47 60.07,72.2 61.99,72.2 62,72.19 62.45,72.63 R27.2 | U2.18 41.4,120.12 C8.1 C5.1 | R18.2 36.01,128.67 36.26,128.93 36.83,128.93 37.08,128.67 R17.2 R16.2 40.03,128.84 v40.03,130.23
  Top 0.2: SWITCH_M7.1 43.36,132.51 v41.68,132.51 | 38.52,112.05 38.52,112.7 38.51,112.71 38.51,112.83 37.84,113.5 37.38,113.5 36.2,114.67 U2.12 | v43.64,122.55 43.64,120.75 C5.1 | v46.34,115.75 46.34,118.45 44.14,120.65 C5.1 | R13.2 34.14,47.25 34.44,46.95 34.44,45.55 R11.2 34.54,45.55 36.54,45.55 R10.2 36.64,45.55 38.64,45.55 R9.2 38.74,45.45 v42.64,41.55 | v42.64,36.95 42.64,36.65 | 27.84,119.05 27.84,115.55 33.04,110.35 33.44,110.35 R19.2 | 27.84,119.05 27.84,119.15 C7.1 | 43.69,92.66 43.34,92.25 44.64,90.95 44.64,89.85 C3.1 C6.1 46.84,89.75 46.84,89.55 47.94,88.45 47.94,81.55 | 47.94,81.55 47.94,81.15 R37.2 | 47.94,81.55 46.24,81.55 45.84,81.15 45.44,81.15 R36.2 45.34,81.15 42.94,81.15 R35.2 42.84,81.15 40.34,81.15 R34.2 40.24,81.05 40.24,80.85 38.74,79.35 38.74,74.95 38.39,74.6 | 47.94,81.55 R37.2 | 28.39,74.9 28.34,74.85 26.94,74.85 26.74,75.05 26.74,81.15 | 28.39,74.9 28.54,75.05 28.54,79.45 30.14,81.05 R30.2 | 33.49,74.9 33.44,74.85 31.84,74.85 | 33.49,74.9 33.64,75.05 33.64,79.45 35.24,81.05 R32.2 | 31.84,74.85 28.44,74.85 28.39,74.9 | 35.99,74.9 35.94,74.85 33.54,74.85 33.49,74.9 | 35.99,74.9 36.14,75.05 36.14,79.25 37.74,80.85 37.74,81.05 R33.2 | 38.39,74.6 38.14,74.85 36.04,74.85 35.99,74.9 | 38.39,74.6 43.84,69.15 43.84,67.15 45.64,65.35 45.64,58.55 43.94,56.85 43.94,53.25 SWITCH_M3.1 | 31.84,74.85 31.84,80.05 32.64,80.85 32.64,81.05 R31.2 32.74,81.15 32.74,82.15 R24.2 34.74,84.05 35.14,83.65 37.34,83.65 37.74,84.05 38.54,84.05 R25.2 39.76,84.06 39.77,84.07 39.77,86.47 37.72,88.53 37.2,88.53 36.75,88.98 U4.12 | 38.52,112.05 v38.84,112.05 | 43.69,92.66 42.79,92.66 41.8,91.67 U4.18
  Top 0.2: U2.4 28.91,120.12 27.84,119.05
  Bottom 0.2: v22.91,82.19 17.4,82.19 14.5,79.3 v14.38,79.3 | v7.39,77.27 7.52,77.14 v10.82,77.14 10.95,77.14 | v35.97,26.47 36.22,26.21 v37.62,26.21 | v37.62,26.21 40.54,23.29 v40.54,14.27 | v16.79,33.71 27.46,33.71 v27.62,33.86 | v41.68,132.51 40.03,130.86 v40.03,130.23 40.04,130.15 40.04,125.75 43.24,122.55 v43.64,122.55 52.54,122.55 55.04,120.05 55.04,119.75 60.94,113.85 61.64,113.85 CONN02.10 | v37.62,26.21 37.64,26.25 37.64,26.55 42.64,31.55 v42.64,36.95 v42.64,41.55 | v2.84,123.35 1.84,122.35 1.84,115.05 3.14,113.75 3.84,113.75 CONN01.10 | v38.84,112.05 40.14,113.35 42.04,113.35 44.34,115.65 46.34,115.65 v46.34,115.75
3_SX1  (via drill 0.35)
  Top 0.2: 27.74,17.45 29.14,17.45 30.01,18.32 v30.14,18.32 | U1.2 32.18,37.45 31.46,38.17 31.46,38.81 31.51,38.86 31.51,39.34 v31.64,39.47 | v29.95,38.46 28.3,38.46 27.43,39.33 26.86,39.33 25.84,38.31 25.84,33.83 25.84,33.6 25.84,33.09 v31.07,27.87 | 27.74,17.45 M_02.5 27.24,17.45 27.74,17.45
  Bottom 0.2: v29.95,38.46 30.24,38.46 31.21,39.42 31.59,39.42 v31.64,39.47 | v31.07,27.87 29.38,26.19 29.38,19.09 v30.14,18.32
3_SX2  (via drill 0.35)
  Top 0.2: U2.2 30.54,120.92 30.18,121.28 30.14,121.25 29.14,121.25 28.64,121.75 26.64,121.75 25.54,120.65 25.54,120.05 25.94,119.65 v25.94,112.55 | v25.94,109.85 25.94,98.05 26.54,97.45 27.14,97.45 M_06.5
  Bottom 0.2: v25.94,112.55 v25.94,109.85
3_SX3  (via drill 0.35)
  Top 0.2: U4.2 32.66,92.47 32.41,92.72 v32.41,93.4 | v16.28,106.86 14.76,108.38 14.76,108.76 14.74,108.85 12.34,111.25 v12.34,116.45
  Bottom 0.2: v32.41,93.4 29.63,96.17 28.26,96.17 27.87,96.57 27.87,98.57 19.58,106.86 v16.28,106.86 | v12.34,116.45 11.64,115.75 10.04,115.75 CONN01.7
4_SX1  (via drill 0.35)
  Top 0.2: 27.74,16.45 29.78,16.45 v31.52,18.2 | v29.48,35.97 29.76,36.25 U1.5 | 27.74,16.45 M_02.4 27.24,16.45 27.74,16.45
  Bottom 0.2: v29.48,35.97 30.34,35.12 30.34,34.38 31.81,32.9 31.81,25.14 30.17,23.5 30.17,22.87 31.52,21.51 v31.52,18.2
4_SX2  (via drill 0.35)
  Top 0.2: U2.5 29.78,119.72 28.85,118.8 28.84,118.75 v28.84,115.75 | v28.54,96.85 28.14,96.45 27.24,96.45 M_06.4 | v31.24,96.75 31.24,111.15 v27.74,114.65
  Bottom 0.2: v28.54,96.85 31.14,96.85 v31.24,96.75 | v28.84,115.75 v27.74,114.65
4_SX3  (via drill 0.35)
  Top 0.2: U4.5 33.08,91.27 31.65,89.84 31.64,89.85 30.94,89.15 30.94,88.85 v30.9,88.78 | R22.2 5.14,75.15 6.54,73.75 8.94,73.75 S2.4 8.94,73.85 S2.3 9.04,79.35 v9.94,80.25
  Bottom 0.2: v9.94,80.25 14.54,80.25 24.29,90 24.94,89.35 30.24,89.35 30.33,89.35 30.34,89.36 30.84,88.85 v30.9,88.78
5_SX1  (via drill 0.35)
  Top 0.2: M_04.4 30.38,56.31 v31.39,55.3 | U1.6 31.57,35.85 v31.01,35.29
  Bottom 0.2: v31.39,55.3 31.8,54.89 31.8,41.96 29.11,39.27 29.11,37.94 31.01,36.03 v31.01,35.29
5_SX2  (via drill 0.35)
  Top 0.2: U2.6 30.65,119.32 30.21,118.88 v30.14,118.95 | v29.94,136.55 29.74,136.75 27.24,136.75 M_08.4 | v29.94,123.75 29.94,122.45 v29.44,121.95
  Bottom 0.2: v29.94,123.75 v29.94,136.55 | v29.44,121.95 29.44,119.65 v30.14,118.95
5_SX3  (via drill 0.35)
  Top 0.2: U4.6 33.24,90.87 32.95,90.57 32.94,90.55 31.64,89.25 v31.64,87.85 | 25.14,76.45 SW1.20 25.14,76.55 25.14,79.35 R15.1 23.62,80.48 v23.41,80.48
  Bottom 0.2: v31.64,87.85 30.73,86.94 30.02,86.94 23.56,80.48 v23.41,80.48
6_SX1  (via drill 0.35)
  Top 0.2: v28.24,34.62 32.91,34.62 33.74,35.45 U1.7 | v17.04,35.25 4.54,22.75 R2.2 4.44,22.75 4.44,22.05 3.44,21.05 SWITCH_M2.2
  Bottom 0.2: v28.24,34.62 17.68,34.62 v17.04,35.25
6_SX2  (via drill 0.35)
  Top 0.2: v31.34,113.05 31.34,116.35 32.54,117.55 32.54,117.64 U2.7 | R6.2 2.54,103.35 v3.94,104.75 3.94,104.65 5.14,104.65 5.44,104.35 5.44,102.35 3.44,100.35 SWITCH_M6.2
  Bottom 0.2: v31.34,113.05 26.44,113.05 26.24,113.25 15.54,113.25 12.54,110.25 8.44,110.25 6.44,108.25 6.44,107.45 3.94,104.95 v3.94,104.75
6_SX3
  Top 0.2: U4.7 33.55,90.47 32.66,89.59 32.64,89.55 32.64,85.85 28.44,81.64 28.44,80.44 27.64,79.64 R29.1 | 27.64,79.35 R29.1 | 27.64,76.45 SW1.19 27.64,76.55 27.64,79.25 R29.1 | 27.64,79.45 R29.1
7_SX1  (via drill 0.35)
  Top 0.2: v11.74,45.95 4.74,52.95 4.74,57.95 SWITCH_M4.2 3.54,59.25 4.54,60.25 4.54,64.05 R4.2 | U1.8 33.63,33.76 30.54,33.76 30.39,33.92 v29.04,33.92
  Bottom 0.2: v29.04,33.92 29.04,35.45 18.54,45.95 v11.74,45.95
7_SX2  (via drill 0.35)
  Top 0.2: U2.8 34.6,117.56 33.93,116.89 33.84,116.85 v32.84,116.85 | v24.24,119.65 24.24,120.05 18.34,125.95 11.74,125.95 4.74,132.95 4.74,137.75 SWITCH_M8.2 3.54,139.05 4.64,140.15 4.64,142.85 R8.2
  Bottom 0.2: v32.84,116.85 27.04,116.85 v24.24,119.65
7_SX3
  Top 0.2: U4.8 35.14,89.65 35.14,87.75 31.84,84.45 31.84,81.15 30.24,79.55 R30.1 | 30.24,79.45 R30.1 | 30.24,76.45 SW1.18 30.24,76.55 30.24,79.35 R30.1
8_SX1  (via drill 0.35)
  Top 0.2: U1.13 36.54,31.25 v39.94,27.85 | 45.04,22.75 v43.64,24.15 | 45.04,22.75 43.94,21.65 43.94,18.85 SWITCH_M1.2 | 45.04,22.75 R1.2
  Bottom 0.2: v43.64,24.15 v39.94,27.85
8_SX2
  Top 0.2: 44.54,103.15 44.54,99.55 SWITCH_M5.2 | 44.54,103.15 44.54,107.39 38.03,113.9 37.54,113.9 36.6,114.84 U2.13 | 44.54,103.15 R5.2
8_SX3
  Top 0.2: 32.74,76.45 SW1.17 32.74,76.55 32.74,79.35 R31.1 34.46,81.15 34.46,81.79 35.88,83.21 39.71,83.21 40.17,83.67 40.17,86.64 37.88,88.93 37.36,88.93 37.15,89.14 U4.13
9_SX1  (via drill 0.35)
  Top 0.2: v39.37,34.6 37.02,34.6 U1.14 | v42.44,57.85 43.84,59.25 SWITCH_M3.2 43.94,59.25 44.64,59.95 44.64,63.05 R3.2
  Bottom 0.2: v39.37,34.6 39.37,54.78 v42.44,57.85
9_SX2  (via drill 0.35)
  Top 0.2: U2.14 37.42,117.72 v37.74,118.05 | R7.2 44.69,139.85 SWITCH_M7.2 43.84,139.05 43.24,138.45 v43.24,137.15 | v43.24,123.55 v41.64,121.95
  Bottom 0.2: v41.64,121.95 v37.74,118.05 | v43.24,137.15 v43.24,123.55
9_SX3
  Top 0.2: SW1.16 35.24,76.45 35.24,79.35 R32.1 35.26,79.64 36.06,80.44 36.06,82.31 36.56,82.81 39.91,82.81 40.6,83.5 40.6,86.81 40.57,86.81 38.05,89.33 37.92,89.33 U4.14
10_SX1
  Top 0.2: U1.15 41.94,35.45 51.14,26.25 60.24,26.25 67.24,19.25 67.24,18.55 M_01.6
10_SX2
  Top 0.2: U2.15 37.9,118.8 39.65,118.8 39.74,118.75 40.04,118.75 45.94,112.85 47.04,112.85 47.34,113.15 54.34,113.15 57.24,110.25 57.24,109.85 66.34,100.75 66.34,99.35 67.24,98.45 M_05.6
10_SX3
  Top 0.2: U4.15 38.34,90.45 38.34,89.73 41.03,87.05 41.03,83.31 40.13,82.41 39.54,82.41 39.46,82.41 38.89,81.84 38.89,80.51 R33.1 | 37.84,79.45 R33.1 | 37.84,76.45 SW1.15 37.84,76.55 37.84,79.35 R33.1
11_SX1
  Top 0.2: U1.16 42.14,35.85 51.34,26.65 60.64,26.65 68.44,18.85 68.44,18.15 67.84,17.55 67.34,17.55 M_01.5
11_SX2  (via drill 0.35)
  Top 0.2: U2.16 40.4,119.32 40.92,118.8 40.94,118.75 40.94,118.45 45.84,113.55 v46.54,113.55 | v47.64,112.45 49.34,110.75 55.74,110.75 65.94,100.55 65.94,98.15 66.64,97.45 67.24,97.45 M_05.5
  Bottom 0.2: v46.54,113.55 v47.64,112.45
11_SX3  (via drill 0.35)
  Top 0.2: 40.34,79.35 R34.1 | 40.34,76.45 SW1.14 40.34,76.55 40.34,79.25 R34.1 | v41.44,80.35 40.44,79.35 R34.1 | v40.94,82.25 41.43,82.73 41.43,87.3 40.04,88.68 40.04,90.45 40.03,90.47 40.03,90.6 39.76,90.87 U4.16
  Bottom 0.2: v40.94,82.25 40.94,80.85 v41.44,80.35
12_SX1
  Top 0.2: U1.19 41.72,37.05 42.82,38.15 42.84,38.15 42.84,38.45 43.74,39.35 51.94,39.35 70.74,20.55 70.74,19.05 68.24,16.55 67.34,16.55 M_01.4
12_SX2
  Top 0.2: U2.19 40.48,120.52 40.97,121 40.97,122.23 42.96,124.23 43.53,124.23 43.92,123.83 43.92,123.27 51.34,115.85 54.14,115.85 66.74,103.25 66.74,100.45 68.44,98.75 68.44,97.05 67.84,96.45 67.34,96.45 M_05.4
12_SX3  (via drill 0.35)
  Top 0.2: 42.94,76.45 SW1.13 42.94,76.55 42.94,79.35 R35.1 43.07,79.41 v43.97,80.31 | U4.19 40.54,92.07 41.24,92.07 v41.94,92.76 | v43.18,89.78 43.18,86.38 42.51,85.72 v42.51,84.32
  Bottom 0.2: v41.94,92.76 41.94,91.02 v43.18,89.78 | v43.97,80.31 43.97,82.86 v42.51,84.32
13_SX1  (via drill 0.35)
  Top 0.2: U1.20 41.54,37.45 | 41.54,37.45 41.55,37.45 | v68.64,57.45 67.84,58.25 67.34,58.25 M_03.6 | v67.54,51.85 55.44,39.75 43.54,39.75 42.04,38.25 42.04,37.95 41.54,37.45
  Bottom 0.2: v68.64,57.45 68.64,52.95 v67.54,51.85
13_SX2  (via drill 0.35)
  Top 0.2: U2.20 40.28,120.92 40.57,121.2 40.57,122.4 42.8,124.63 43.85,124.63 44.6,123.88 63.29,123.88 v66.19,126.78 | M_07.6 67.4,138.68 70.33,138.68 70.41,138.61 v70.51,138.61
  Bottom 0.2: v66.19,126.78 66.19,127.47 66.4,127.68 66.4,135.46 69.21,138.27 70.17,138.27 v70.51,138.61
13_SX3  (via drill 0.35)
  Top 0.2: 45.44,76.45 SW1.12 45.44,76.55 45.44,79.35 R36.1 | U4.20 40.5,92.47 | 40.5,92.47 40.54,92.51 | 40.5,92.47 40.54,92.55 v40.54,94.37 | 45.34,79.35 R36.1 | R36.1 46.44,80.44 v46.49,80.44 | v49.3,85.52 49.3,83.36 v48.79,82.85
  Bottom 0.2: v40.54,94.37 41.47,93.44 42.22,93.44 42.61,93.04 42.61,91.58 42.57,91.53 42.57,90.97 42.96,90.57 43.51,90.57 48.56,85.52 v49.3,85.52 | v46.49,80.44 46.51,80.46 46.51,81.97 47.4,82.85 v48.79,82.85
14_SX1  (via drill 0.35)
  Top 0.2: U1.21 41.25,37.85 41.55,38.15 41.64,38.15 41.64,38.45 v45.84,42.65 | v45.84,51.25 45.84,57.95 46.04,58.15 46.04,60.55 51.74,66.25 60.24,66.25 65.94,60.55 65.94,58.05 66.64,57.35 67.24,57.35 M_03.5
  Bottom 0.2: v45.84,42.65 v45.84,51.25
14_SX2  (via drill 0.35)
  Top 0.2: U2.21 39.9,121.32 40.17,121.58 40.17,122.56 42.63,125.03 44.01,125.03 44.77,124.28 62.66,124.28 67.97,129.59 67.97,131.24 v67.59,131.62 | M_07.5 68.77,137.81 68.99,137.59 v69.49,137.59
  Bottom 0.2: v67.59,131.62 67.59,135.69 v69.49,137.59
14_SX3  (via drill 0.35)
  Top 0.2: U4.21 38.34,92.95 38.95,92.95 v39.28,93.28 | 47.94,76.45 SW1.11 47.94,76.55 47.94,79.35 R37.1 47.94,79.45 48.56,79.45 v49.43,80.31
  Bottom 0.2: v39.28,93.28 39.67,93.28 41.14,91.81 41.14,90.29 42.73,88.7 44.25,88.7 50.57,82.38 50.57,81.2 49.68,80.31 v49.43,80.31
15_SX1  (via drill 0.35)
  Top 0.2: v46.84,44.65 40.84,38.65 36.94,38.65 U1.22 | v66.14,61.35 66.14,60.95 69.34,57.75 69.34,57.15 68.54,56.35 67.34,56.35 M_03.4
  Bottom 0.2: v46.84,44.65 58.94,44.65 66.14,51.85 v66.14,61.35
15_SX2
  Top 0.2: U2.22 39.26,122.09 39.77,122.6 39.77,122.73 42.47,125.43 44.19,125.43 44.95,124.68 62.49,124.68 66.1,128.28 66.1,136.13 66.38,136.41 66.87,136.41 M_07.4 67.34,136.75
15_SX3  (via drill 0.35)
  Top 0.2: v65.04,72.65 65.54,72.15 67.04,72.15 67.84,72.95 R28.2 | U4.22 37.55,93.96 38.25,94.67 38.55,94.37 v39.14,94.37
  Bottom 0.2: v65.04,72.65 58.44,79.25 52.74,79.25 51.97,80.03 51.97,81.55 44.41,89.1 42.89,89.1 41.54,90.46 41.54,91.98 v39.14,94.37
!INT_SX1
  Top 0.2: U1.9 34.94,29.4 R12.1
!INT_SX2
  Top 0.2: U2.9 35,113.5 R19.1
!INT_SX3
  Top 0.2: U4.9 35.55,87.39 34.65,86.49 R24.1
!RESET_SX1
  Top 0.2: R9.1 36.54,41.66 U1.23
!RESET_SX2
  Top 0.2: U2.23 36.6,125.15 37.58,126.12 38.39,126.12 39.24,126.97 R16.1
!RESET_SX3
  Top 0.2: U4.23 37.15,98.7 R14.1
ADDR0_SX1
  Top 0.2: U1.26 35.34,41.89 34.27,42.96 32.96,42.96 32.68,43.25 | 32.68,43.25 32.26,43.66 | JP8.1 32.68,43.65 32.68,43.25
ADDR0_SX2
  Top 0.2: U2.26 35.4,123.68 33.3,125.78 33.3,127.18 JP7.1
ADDR0_SX3
  Top 0.2: JP11.1 33.15,100.36 33.05,100.25 33.05,98.27 32.74,97.97 32.74,97.4 35.95,94.19 U4.26
ADDR1_SX1
  Top 0.2: U1.10 35.34,30.39 36.28,29.46 36.28,28.73 JP9.1
ADDR1_SX2
  Top 0.2: 35.08,112.39 35.08,112.22 | U2.10 35.4,112.71 35.08,112.39 | JP6.1 35.33,112.39 35.08,112.39
ADDR1_SX3
  Top 0.2: U4.10 35.95,86.05 36.2,85.8 36.2,85.78 | 36.2,85.78 36.2,85.37 36.2,85.14 | JP10.1 36.61,85.37 36.2,85.78
CAN_RX2  (via drill 0.35)
  Top 0.2: v7.74,117.95 7.74,113.35 12.24,108.85 12.64,108.85 13.04,108.45 13.04,107.85 11.04,105.85 v10.84,105.85
  Bottom 0.2: v7.74,117.95 6.04,119.65 3.94,119.65 CONN01.4 | v10.84,105.85 8.54,105.85 5.94,103.25 3.24,103.25 2.44,104.05 2.44,107.65 JP3.4
CAN_TX2  (via drill 0.35)
  Top 0.2: v12.04,118.75 12.04,117.15 11.64,116.75 11.64,110.45 v12.54,109.55
  Bottom 0.2: v12.04,118.75 11.14,119.65 10.04,119.65 CONN01.3 | v12.54,109.55 10.34,109.55 8.84,108.05 8.84,107.35 5.54,104.05 3.64,104.05 3.24,104.45 3.24,105.05 5.04,106.85 5.04,107.65 JP3.3
GND_MCU  (via drill 0.35)
  Top 0.2: C5.2 C8.2 41.23,119.72 U2.17 36.2,119.72 U2.29 35.4,120.52 U2.3 28.19,120.52 C7.2 27.74,120.85 26.74,120.85 v26.24,120.35 | 30.94,37.05 U1.3 34.34,37.05 34.74,36.65 U1.29 36.14,36.25 U1.17 42.82,36.25 43.47,35.6 C4.2 44.04,35.65 46.24,35.65 C2.2 | C1.2 27.46,37.05 30.94,37.05 | 43.05,91.27 U4.17 36.49,91.27 36.09,91.67 | 43.05,91.27 43.85,90.46 43.85,89.1 44.65,88.3 C3.2 C6.2 | 31.67,91.25 32.49,92.07 U4.3 34.92,92.07 35.32,91.67 36.09,91.67 | R3.1 42.84,63.15 42.84,67.75 SW1.8 42.74,67.75 40.44,67.75 SW1.7 40.34,67.85 37.84,67.85 SW1.6 37.74,67.85 35.34,67.85 SW1.5 35.24,67.85 32.74,67.85 SW1.4 32.64,67.85 30.24,67.85 SW1.3 30.14,67.85 27.74,67.85 SW1.2 | 29.09,90.4 29.14,90.35 29.54,90.35 C9.2 30.7,90.28 31.67,91.25 | 29.09,90.4 27.24,92.25 27.24,93.35 M_06.1 | 27.14,67.85 27.64,67.85 SW1.2 | 27.14,67.85 25.14,67.85 SW1.1 25.14,67.95 22.11,70.98 22.11,82.62 29.04,89.55 29.04,90.35 29.09,90.4 | v27.14,51.25 27.14,53.25 M_04.1 27.25,53.39 v29.49,53.39 | v27.14,38.65 27.14,37.45 C1.2 | 30.94,37.05 30.94,47.34 31.74,48.15 37.54,48.15 40.34,45.35 60.44,45.35 66.64,51.55 66.64,51.95 67.24,52.55 67.24,53.25 M_03.1 | R1.1 37.64,22.75 36.03,24.37 | 36.03,24.37 26.24,34.15 26.24,36.55 27.04,37.35 C1.2 | v27.14,63.75 27.14,67.85 | 27.14,67.85 SW1.2 | 26.89,12.6 20.24,5.95 7.84,5.95 1.74,12.05 1.74,21.95 2.54,22.75 R2.1 2.44,22.75 2.44,51.75 1.74,52.45 1.74,63.15 2.64,64.05 R4.1 2.74,64.05 2.74,74.75 5.04,77.05 R22.1 5.04,77.15 2.14,80.05 2.14,100.05 2.99,100.9 | 26.89,12.6 27.14,12.85 27.14,13.35 M_02.1 | 26.89,12.6 37.44,2.05 57.14,2.05 67.24,12.15 67.24,13.45 M_01.1
  Top 0.2: 34.19,138.1 38.94,142.85 R7.1 | 34.19,138.1 29.94,133.85 27.24,133.85 M_08.1 | 34.19,138.1 26.04,146.25 6.14,146.25 3.74,143.85 3.74,143.75 2.84,142.85 R8.1 2.74,142.85 2.74,140.85 2.14,140.25 2.14,115.85 6.24,111.75 v6.34,111.75 7.54,110.55 7.54,107.75 JP3.2 7.44,107.75 6.74,107.75 4.44,105.45 2.74,105.45 1.64,104.35 1.64,102.25 2.99,100.9 | 2.99,100.9 4.44,102.35 4.44,103.35 R6.1 | SW1.9 45.44,67.85 47.94,67.85 SW1.10 48.04,67.85 58.84,67.85 63.94,72.95 63.94,76.05 POWE_3.3.2 64.04,76.15 65.44,77.55 68.14,77.55 68.19,77.5 | 68.19,77.5 69.44,76.25 STATUS_LED.2 | 67.24,133.75 M_07.1 68.3,132.79 68.3,131.79 68.48,131.61 69.47,131.61 70.51,130.57 v70.51,122.44 | 44.14,118.95 C5.2 | v69.44,95.05 67.84,93.45 67.34,93.45 M_05.1 | v43.84,104.55 42.74,103.45 42.74,103.15 R5.1 | v43.24,91.25 43.14,91.25 43.05,91.27 | v68.24,89.75 68.24,77.55 68.19,77.5 | 31.67,91.25 31.61,91.32 31.54,91.32 31.54,96.05 31.94,96.45 31.94,98.35 31.64,98.65 31.67,98.67 31.67,103.76 32.51,104.61 33.86,104.61 34.04,104.43 34.04,102.32 34.08,102.27 34.08,100.37 33.94,100.23 v33.94,99.65 | JP9.2 36.7,25.04 36.03,24.37 | JP7.2 32.36,128.24 32.16,128.45 32.14,128.45 29.84,128.45 29.54,128.75 28.94,128.75 25.84,125.65 v25.84,121.95 | 44.19,116.9 47.54,113.55 54.54,113.55 v57.94,110.15 | 44.19,116.9 44.14,116.95 44.14,118.85 C5.2 | v43.74,116.85 44.14,116.85 44.19,116.9 | 36.09,91.67 U4.29
  Bottom 0.2: v27.14,38.65 v27.14,51.25 27.14,53.39 | 27.14,53.39 v27.14,63.75 | CONN02.11 67.94,111.65 69.44,110.15 v69.44,95.05 69.44,94.65 68.24,93.45 v68.24,89.75 | 57.94,109.25 65.44,109.25 67.84,111.65 CONN02.11 | 57.94,109.25 55.04,109.25 50.34,104.55 v43.84,104.55 43.24,103.95 43.24,99.65 | 43.24,99.65 v43.24,91.25 | 57.94,109.25 v57.94,110.15 | CONN02.11 67.84,111.75 CONN02.9 67.84,113.85 68.54,113.85 70.64,115.95 70.64,122.31 v70.51,122.44 | v6.34,111.75 9.94,111.75 CONN01.11 10.04,111.75 10.04,113.65 CONN01.9 10.04,113.75 14.64,113.75 21.24,120.35 25.84,120.35 | 43.24,99.65 v33.94,99.65 | v29.49,53.39 27.14,53.39 | 25.84,120.35 v25.84,121.95 | 25.84,120.35 v26.24,120.35 27.74,120.35 30.54,117.55 35.84,117.55 37.34,116.05 42.94,116.05 v43.74,116.85
  other vias: 31.6,143.97 28.98,110.36 39.95,106.83 44.86,110.54 9.7,124.76 45.39,126.82 68,66.8 53.95,83.03 28.04,106.25 23.42,123.24
  pour Top: -12.09,153.11 83.39,153.11 83.39,-12.5 -12.09,-12.5
  pour Bottom: -11.56,157.91 83.16,157.91 83.16,-9.7 -11.56,-9.7
N$5
  Top 0.2: JP6.2 36.89,111.2 R21.1
N$8
  Top 0.2: R13.1 32.69,46.98 32.69,45.28 32.6,45.2 | 32.26,44.68 32.26,44.86 32.6,45.2 | JP8.2 32.6,44.76 32.6,45.2
N$13
  Top 0.2: R28.1 66.14,73.05 66.14,76.15 STATUS_LED.1
N$14
  Top 0.2: R25.1 37.74,84.92 37.74,84.51 37.7,84.46 37.55,84.46 37.44,84.35 37.11,84.35 37.05,84.35 JP10.2
N$15
  Top 0.2: 32.72,101.83 32.72,102.01 32.83,102.12 | R26.1 33.19,102.47 32.83,102.12 | JP11.2 33.12,101.83 32.83,102.12
N$193
  Top 0.2: R27.1 60.74,73.05 60.74,76.05 POWE_3.3.1
NEOPIXEL_01  (via drill 0.35)
  Top 0.2: v68.64,15.95 68.24,15.55 67.34,15.55 M_01.3 | v66.84,91.15 v66.84,89.15 | v68.74,108.75 68.74,115.75 v63.74,120.75
  Bottom 0.2: v68.64,15.95 68.64,49.75 66.84,51.55 v66.84,89.15 | v66.84,91.15 66.84,92.65 68.74,94.55 v68.74,108.75 | v63.74,120.75 62.74,120.75 61.74,121.75 CONN02.2
NEOPIXEL_02  (via drill 0.35)
  Top 0.2: v66.14,91.85 v52.84,78.55 | v68.04,109.45 68.04,115.45 v65.54,117.95 | M_02.3 27.24,15.45 30.03,15.45 32.54,17.96 v32.54,20.25
  Bottom 0.2: v32.54,20.25 32.54,24.25 40.14,31.84 40.14,54.54 48.34,62.75 48.34,74.05 v52.84,78.55 | v66.14,91.85 66.14,92.55 68.04,94.45 v68.04,109.45 | v65.54,117.95 65.54,118.35 65.84,118.65 65.84,120.35 67.24,121.75 67.74,121.75 CONN02.1
NEOPIXEL_03  (via drill 0.35)
  Top 0.2: v69.34,56.15 68.54,55.35 67.34,55.35 M_03.3 | v67.34,110.15 67.34,114.95 v63.94,118.35
  Bottom 0.2: v69.34,56.15 69.34,87.65 65.44,91.55 65.44,92.45 67.34,94.35 v67.34,110.15 | v63.94,118.35 63.74,118.35 62.34,119.75 61.74,119.75 CONN02.4
NEOPIXEL_04  (via drill 0.35)
  Top 0.2: v34.64,51.25 33.74,51.25 29.74,55.25 27.24,55.25 M_04.3 | v42.54,95.05 46.14,98.65 46.14,100.65 v55.44,109.95
  Bottom 0.2: v34.64,51.25 34.64,43.45 36.14,41.95 36.74,41.95 37.14,42.35 37.14,94.25 37.94,95.05 v42.54,95.05 | v55.44,109.95 56.74,109.95 57.64,110.85 59.34,110.85 59.74,110.45 63.64,110.45 65.84,112.65 65.84,116.35 66.34,116.85 69.54,116.85 69.84,117.15 69.84,118.35 68.44,119.75 CONN02.3
NEOPIXEL_05  (via drill 0.35)
  Top 0.2: v59.64,116.75 70.74,105.65 70.74,98.35 67.84,95.45 67.34,95.45 M_05.3
  Bottom 0.2: v59.64,116.75 60.64,116.75 61.64,117.75 CONN02.6
NEOPIXEL_06  (via drill 0.35)
  Top 0.2: v29.84,102.15 28.14,100.45 28.14,98.95 29.24,97.85 29.24,96.55 28.14,95.45 27.24,95.45 M_06.3
  Bottom 0.2: v29.84,102.15 40.44,102.15 49.04,110.75 56.94,110.75 57.44,111.25 59.54,111.25 59.94,110.85 63.44,110.85 65.44,112.85 65.44,116.55 66.64,117.75 67.74,117.75 CONN02.5
NEOPIXEL_07  (via drill 0.35)
  Top 0.2: 67.34,135.75 M_07.3 v68.98,135.81 v68.99,135.81 | v67.08,127.69 67.08,124.64 v65.3,122.86
  Bottom 0.2: CONN02.8 61.74,115.85 62.44,115.85 65.44,118.85 65.3,118.99 v65.3,122.86 | v68.99,135.81 68.99,129.59 v67.08,127.69
NEOPIXEL_08  (via drill 0.35)
  Top 0.2: v33.14,138.05 30.94,135.85 27.24,135.85 M_08.3 | v56.24,121.45 69.14,121.45 v69.94,120.65
  Bottom 0.2: v33.14,138.05 34.14,138.05 34.84,138.75 42.64,138.75 45.84,135.55 45.84,131.85 v56.24,121.45 | v69.94,120.65 69.94,118.85 70.24,118.55 70.24,116.95 69.14,115.85 67.84,115.85 CONN02.7
RX7  (via drill 0.35)
  Top 0.2: v5.94,124.45 v5.94,118.75
  Bottom 0.2: v5.94,118.75 4.94,117.75 3.94,117.75 CONN01.6 | v5.94,124.45 3.44,126.95 JP2.2
SCL_00  (via drill 0.35)
  Top 0.2: U2.25 35.8,126.58 R18.1 35.34,127.05 35.34,127.25 34.24,128.35 34.24,128.65 33.74,129.15 v25.84,129.15 | U1.25 35.74,41.99 35.78,42.02 34.5,43.3 R11.1 34.54,43.85 34.74,43.85 v35.54,44.65 | U4.25 36.35,95.28 | 36.35,95.28 36.35,97.97 35.03,99.29 R23.1 | 36.35,95.28 35.84,95.79 v35.49,95.79
  Bottom 0.2: v25.84,129.15 23.44,129.15 16.84,122.55 4.74,122.55 4.69,122.5 | 4.69,122.5 3.94,121.75 CONN01.2 | v35.54,44.65 35.54,95.85 v35.49,95.79 34.86,95.79 34.82,95.78 33.15,97.45 29.64,97.45 19.45,107.65 13.24,107.65 13.14,107.65 12.04,106.55 8.64,106.55 5.74,103.65 3.44,103.65 2.84,104.25 2.84,105.25 3.74,106.15 3.74,108.25 1.44,110.55 1.44,122.95 3.14,124.65 3.74,124.65 4.64,123.75 4.64,122.55 4.69,122.5
SDA_00  (via drill 0.35)
  Top 0.2: U2.24 36.2,125.41 R17.1 37.74,127.05 v36.54,128.25 | R10.1 36.47,43.69 36.47,42.65 | 36.47,42.65 36.47,42.16 36.14,41.83 U1.24 | R20.1 36.7,98.85 | 36.7,98.85 36.7,98.18 36.75,98.13 U4.24 | 36.7,98.85 v36.44,98.85 | v36.44,42.65 36.47,42.65 | v14.44,121.35 14.44,111.65 20.34,105.75 v25.24,105.75
  Bottom 0.2: v36.54,128.25 36.54,131.45 28.84,139.15 28.24,139.15 26.54,137.45 26.54,128.85 21.14,123.45 18.34,123.45 16.64,121.75 14.44,121.75 | 14.44,121.75 10.04,121.75 CONN01.1 | v36.44,42.65 v36.44,98.85 33.74,98.85 32.94,99.65 31.34,99.65 v25.24,105.75 | v14.44,121.35 14.44,121.75
TX7  (via drill 0.35)
  Top 0.2: v7.74,119.05 7.74,125.25 6.04,126.95 JP2.1
  Bottom 0.2: v7.74,119.05 9.04,117.75 9.94,117.75 CONN01.5
VCC_5V  (via drill 0.35)
  Top 0.35: M_08.2 26.85,134.49 26.24,134.49 26.02,134.27 26.02,132.77 | 26.02,132.77 26.02,131.82 25.04,130.84 25.04,114.99 23.83,113.77 23.14,113.77 | 23.14,113.77 S1.2 | 26.02,132.77 27.11,132.77 28.34,131.54 46.06,131.54 51.7,125.89 57.49,125.89 57.63,126.03 v58.74,126.03 | M_02.2 27.5,14.09 29.45,14.09 30.67,12.87 30.67,10.91 33.28,8.31 | M_01.2 66.95,14.19 66.34,14.19 66.12,13.97 66.12,11.77 56.95,2.59 38.99,2.59 33.3,8.29 33.29,8.3 33.28,8.31 | M_04.2 26.85,53.99 26.24,53.99 26.02,53.77 26.02,51.67 24.81,50.45 | 24.81,50.45 19.33,44.97 19.33,33.07 26.95,25.45 32.03,25.45 33.3,24.18 33.3,16.45 33.28,16.42 33.28,15.76 | 33.28,15.76 33.3,15.74 | 33.28,15.76 33.28,8.31 | 35.84,50.45 47.14,50.45 51.7,45.89 60.25,45.89 66.12,51.77 66.12,53.77 66.34,53.99 66.95,53.99 M_03.2 69.78,54.31 v70.13,54.66 | 35.84,50.45 24.81,50.45 | 35.84,50.45 35.84,59.74 32.66,62.92 23.77,62.92 19.96,66.73 19.96,85.61 26.02,91.67 26.02,93.87 26.24,94.09 26.85,94.09 M_06.2 27.5,94.74 28.1,94.74 30.67,97.31 30.67,106.24 23.14,113.77 | M_05.2 66.95,94.09 66.34,94.09 66.12,93.87 66.12,92.96 70.72,88.36 70.72,64.39 v70.51,64.19 | v70.51,134.67 70.37,134.81 M_07.2
  Bottom 0.35: v70.51,64.19 70.51,55.05 v70.13,54.66 | v58.74,126.03 66.57,126.03 70.72,130.18 70.72,134.46 v70.51,134.67
VCC_5V_IN  (via drill 0.35)
  Top 0.35: v15.14,116.55 17.84,116.55 19.04,117.75 22.14,117.75 S1.3
  Bottom 0.35: v15.14,116.55 13.54,116.55 11.64,114.65 7.54,114.65 4.64,111.75 3.94,111.75 CONN01.12 5.04,111.95 6.24,110.75 12.34,110.75 15.44,113.85 41.84,113.85 44.54,116.55 46.64,116.55 49.94,113.25 54.34,113.25 55.84,111.75 61.64,111.75 CONN02.12

### Text on the board
tPlace: gnd | gnd | 8 | 8 | 7 | 7 | 6 | 6 | 5 | 5 | 4 | 4 | 3 | 3 | gnd | gnd | 2 | 2 | 1 | 1